# Altium project TechDemo.PrjPcb (part 1 of 2)
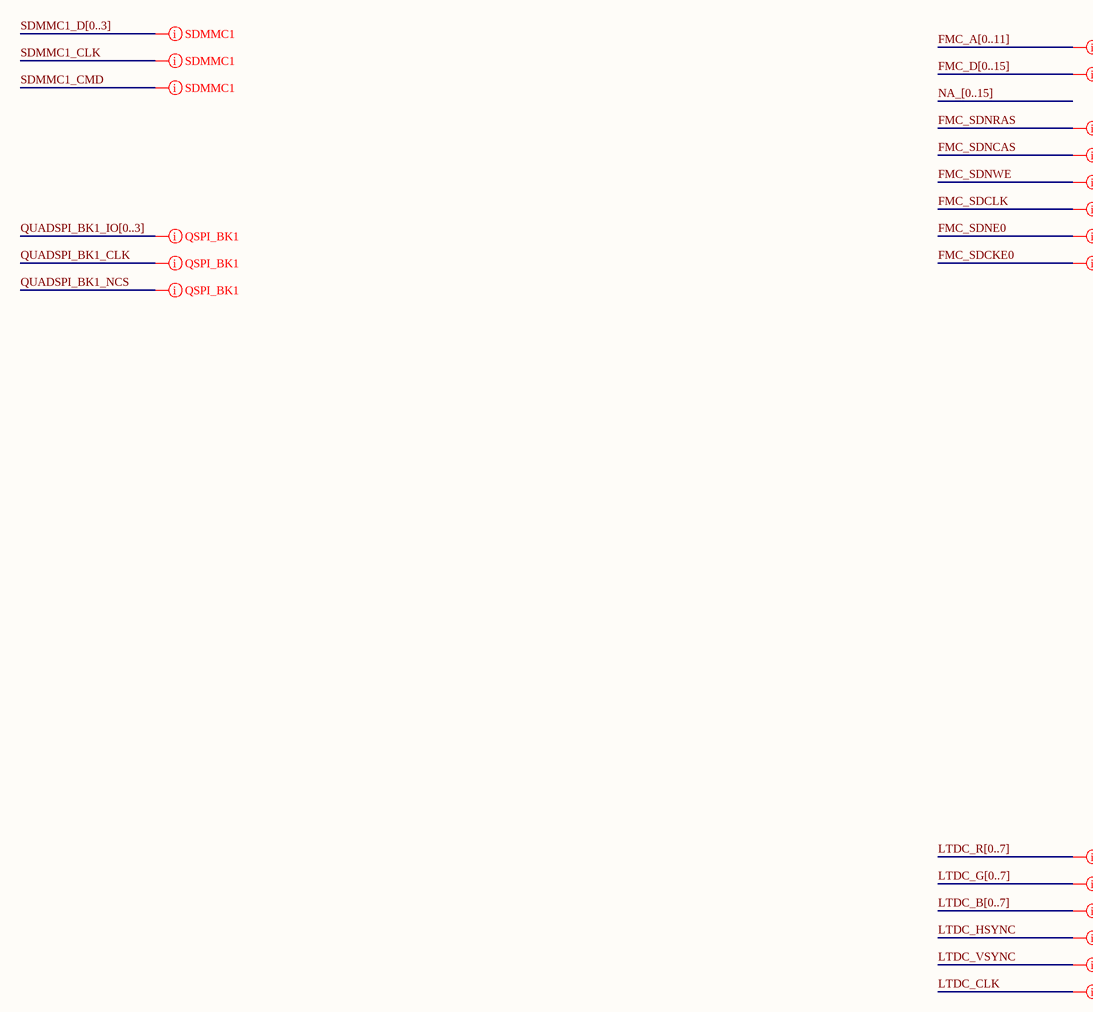
[diagram p0: TitleBlock.SchDoc]
ProjectDate: 10/29/2020; ProjectNumber: IMR_002; ProjectRevision: 1; ProjectTitle: IMR Technology Demonstrator
10 sheets, 244 parts. Net scope: global (net labels, ports and power ports of the same name join across sheets).
Board file: PCB_TechDemo.PcbDoc
Sheets:
  TitleBlock.SchDoc
  MainController.SchDoc
  MainControllerPower.SchDoc
  SystemMemory.SchDoc
  LCD_TouchBackLight.SchDoc
  SerialInterface.SchDoc
  UserInteractive.SchDoc
  AudioAmp.SchDoc
  Wifi.SchDoc
  Power.SchDoc

## Sheet TitleBlock.SchDoc: =ProjectTitle
size B; Date: 10/29/2020; Engineer: H. Collector; Organization: IMR Engineering; Address1: 3621 Gin Way; Address2: Snellville, GA 30039; Address3: USA; DocumentNumber: IMR_002; Revision: 1; SheetNumber: 1; SheetTotal: 10; Rule: UNIONINDEX=0|RULEKIND=MatchedLengths|NETSCOPE=DifferentNets|LAYERKIND=SameLayer|NAME=Schematic Matched Net Lengths|TOLERANCE=100mil|CHECKNETSINDIFFPAIR=FALSE|CHECKDIFFPAIRVSDIFFPAIR=TRUE|CHECKXSIGNALS=TRUE|CHECKOTHERS=TRUE|UNIT=Metric

### Buses and harness runs
bus FMC_A[0..11]
bus FMC_D[0..15]
bus LTDC_B[0..7]
bus LTDC_G[0..7]
bus LTDC_R[0..7]
bus NA_[0..15]
bus QUADSPI_BK1_IO[0..3]
bus SDMMC1_D[0..3]

### Layout directives
mark named TFT_LCD: (no net found under the mark), LTDC_CLK, LTDC_HSYNC, LTDC_VSYNC
rule Matched Net Lengths [Tolerance = 28mm]: (no net found under the mark)
rule Matched Net Lengths [Tolerance = 38mm]: (no net found under the mark), QUADSPI_BK1_CLK, QUADSPI_BK1_NCS, SDMMC1_CLK, SDMMC1_CMD
rule Matched Net Lengths [Tolerance = 28mm]; net class FMC_CTL: FMC_SDCKE0, FMC_SDCLK, FMC_SDNCAS, FMC_SDNE0, FMC_SDNRAS, FMC_SDNWE

### Notes on the sheet
- Title
- Size:
- Date:
- B
- Number:
- Engr:
- Revision:
- Sheet
- of
- File:

## Sheet MainController.SchDoc: =ProjectTitle
size B; Engineer: H. Collector; Organization: IMR Engineering; Address1: 3621 Gin Way; Address2: Snellville, GA 30039; Address3: USA; DocumentNumber: IMR_002; Revision: 1; SheetNumber: 2; SheetTotal: 10
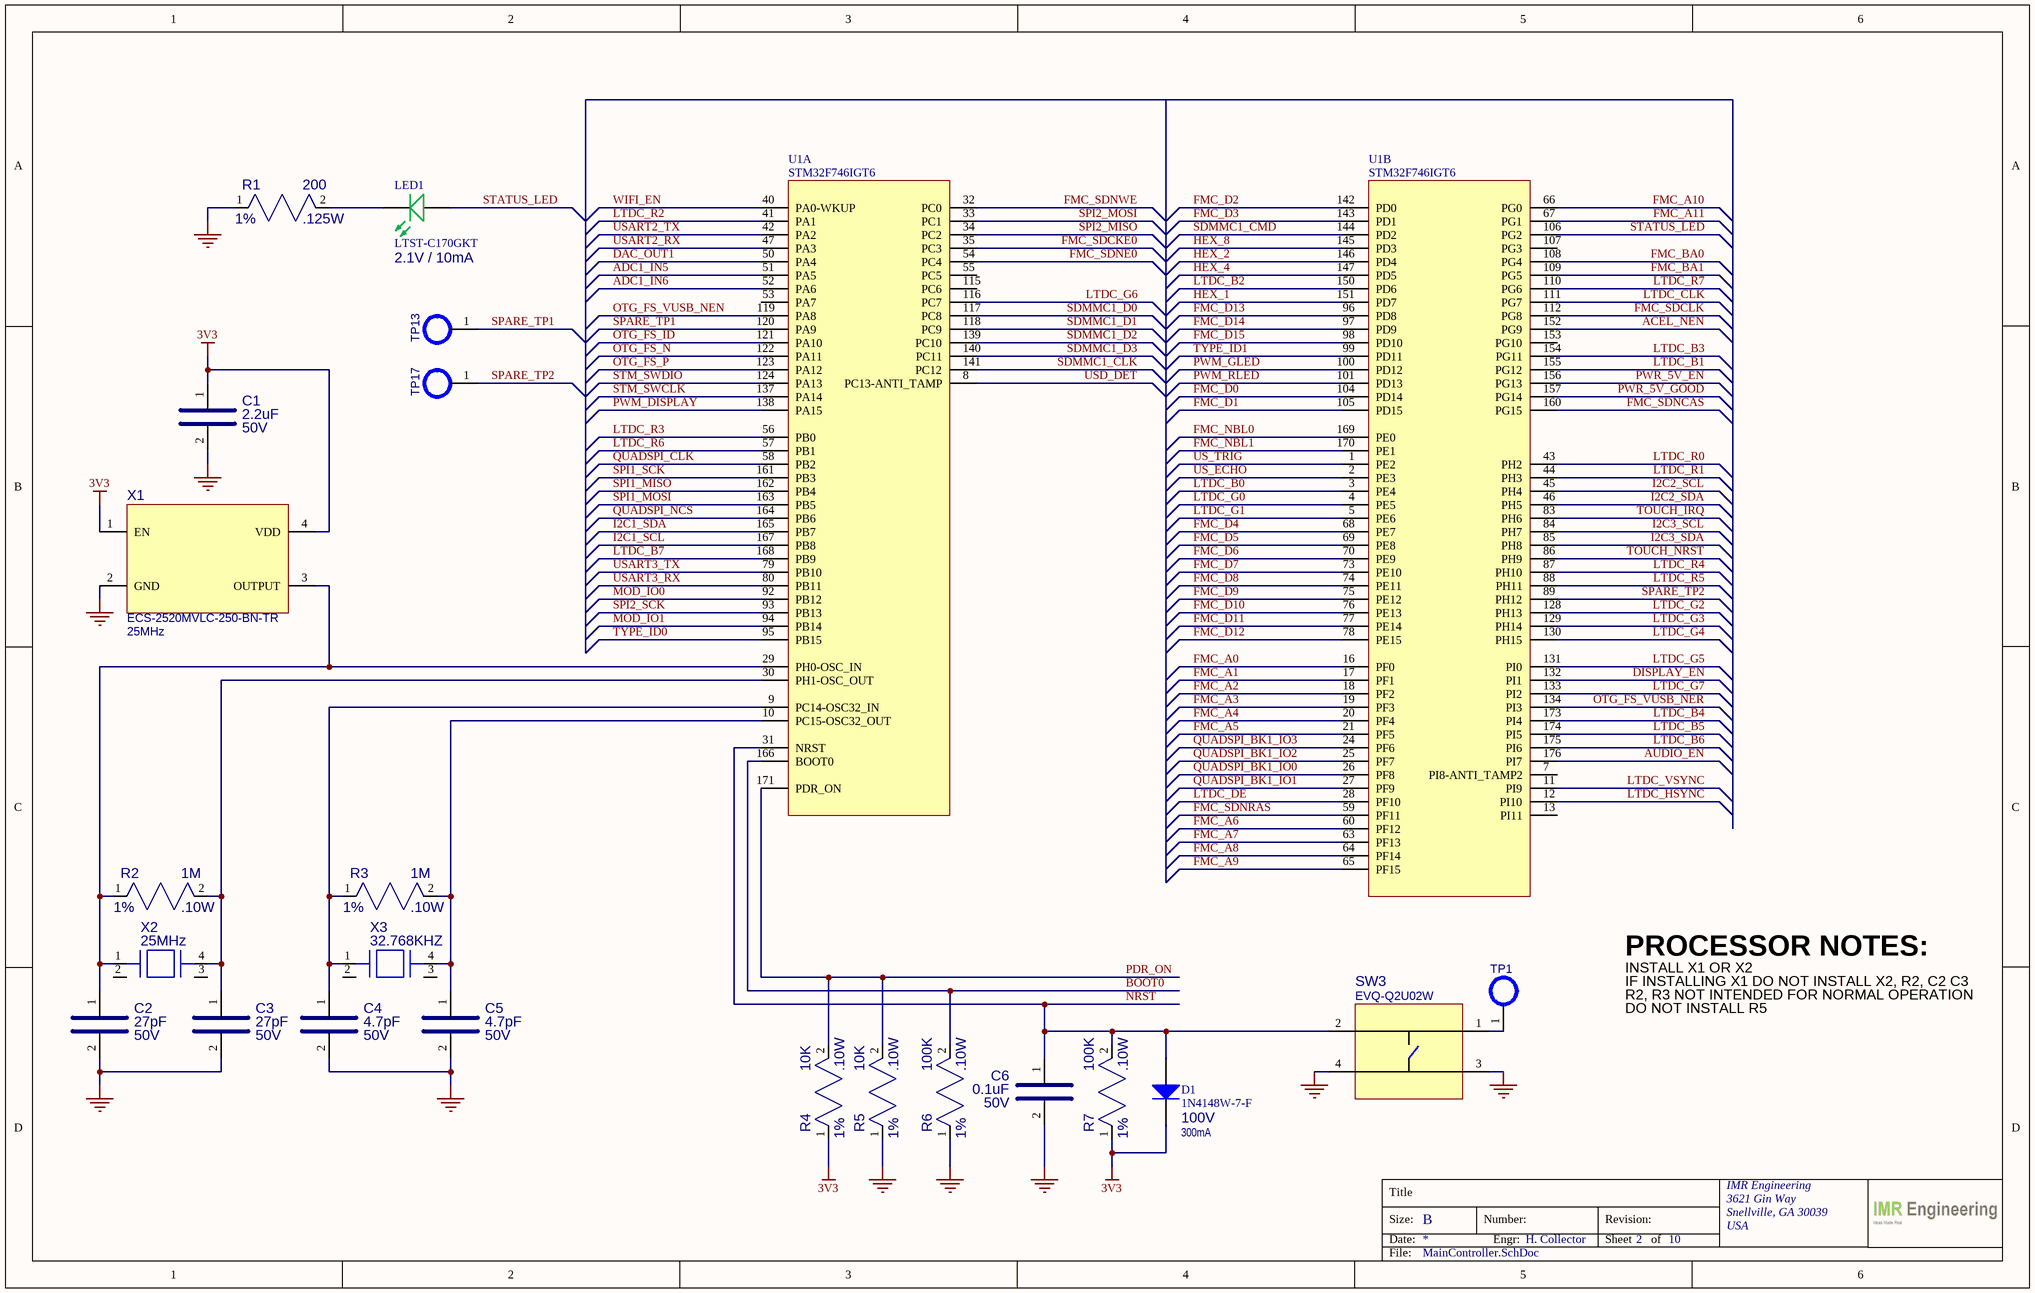
[diagram p1: MainController.SchDoc]

### Parts
C1  value 2.2uF  VOLTAGE: 50V  [CAP_0805]  (hidden comment: UMK212BB7225MG-T)
C2  value 27pF  VOLTAGE: 50V  [CAP_0603]  (hidden comment: CC0603KRNPO9BN270)
C3  value 27pF  VOLTAGE: 50V  [CAP_0603]  (hidden comment: CC0603KRNPO9BN270)
C4  value 4.7pF  VOLTAGE: 50V  [CAP_0603]  (hidden comment: CC0603CRNPO9BN4R7)
C5  value 4.7pF  VOLTAGE: 50V  [CAP_0603]  (hidden comment: CC0603CRNPO9BN4R7)
C6  value 0.1uF  VOLTAGE: 50V  [CAP_0603]  (hidden comment: CC0603KRX7R9BB104)
D1  value 100V  CURRENT: 300mA  [SOD123]  (hidden comment: 1N4148W-7-F)
LED1  value 2.1V / 10mA  [PMG_LTST-C170GKT]  (hidden comment: LTST-C170GKT)
R1  value 200  TOLERANCE: 1%  POWER: .125W  [RES_0805]  (hidden comment: RC0805FR-07200RL)
R2  value 1M  TOLERANCE: 1%  POWER: .10W  [RES_0603]  (hidden comment: RC0603FR-071ML)
R3  value 1M  TOLERANCE: 1%  POWER: .10W  [RES_0603]  (hidden comment: RC0603FR-071ML)
R4  value 10K  TOLERANCE: 1%  POWER: .10W  [RES_0603]  (hidden comment: RC0603FR-0710KL)
R5  value 10K  TOLERANCE: 1%  POWER: .10W  [RES_0603]  (hidden comment: RC0603FR-0710KL)
R6  value 100K  TOLERANCE: 1%  POWER: .10W  [RES_0603]  (hidden comment: RC0603FR-07100KL)
R7  value 100K  TOLERANCE: 1%  POWER: .10W  [RES_0603]  (hidden comment: RC0603FR-07100KL)
SW3  EVQ-Q2U02W  [SW_EVQ-Q2U02W]
TP1  TP_0635MM_HOLE  [TP_0635MM_HOLE]  (value not drawn)  (no BOM)
TP13  TP_0635MM_HOLE  [TP_0635MM_HOLE]  (value not drawn)  (no BOM)
TP17  TP_0635MM_HOLE  [TP_0635MM_HOLE]  (value not drawn)  (no BOM)
U1  STM32F746IGT6  [QFP50P2600X2600X160-176N]  (parts A,B of 3)
X1  value 25MHz  [OSC_ECS-2520S25-250-FN-TR]  (hidden comment: ECS-2520MVLC-250-BN-TR)
X2  value 25MHz  [XTAL_ECS]  (hidden comment: ECS-250-18-7SX-TR)
X3  value 32.768KHZ  [XTAL_ECS-.327-6-17X-TR]  (hidden comment: MC-306 32.7680K-E0:PURE SN)

### Nets
3V3: C1.1 D1.2(K) R4.1 R7.1 X1.1(EN) X1.4(VDD)
GND: C1.2 C2.2 C3.2 C4.2 C5.2 C6.2 R1.1 R5.1 R6.1 SW3.3(A) SW3.4(A') X1.2(GND)
ACEL_NEN: U1.152(PG9)
ADC1_IN5: U1.51(PA5)
ADC1_IN6: U1.52(PA6)
AUDIO_EN: U1.176(PI7)
BOOT0: R6.2 U1.166(BOOT0)
DAC_OUT1: U1.50(PA4)
DISPLAY_EN: U1.132(PI1)
FMC_A0: U1.16(PF0)
FMC_A1: U1.17(PF1)
FMC_A2: U1.18(PF2)
FMC_A3: U1.19(PF3)
FMC_A4: U1.20(PF4)
FMC_A5: U1.21(PF5)
FMC_A6: U1.60(PF12)
FMC_A7: U1.63(PF13)
FMC_A8: U1.64(PF14)
FMC_A9: U1.65(PF15)
FMC_A10: U1.66(PG0)
FMC_A11: U1.67(PG1)
FMC_BA0: U1.108(PG4)
FMC_BA1: U1.109(PG5)
FMC_D0: U1.104(PD14)
FMC_D1: U1.105(PD15)
FMC_D2: U1.142(PD0)
FMC_D3: U1.143(PD1)
FMC_D4: U1.68(PE7)
FMC_D5: U1.69(PE8)
FMC_D6: U1.70(PE9)
FMC_D7: U1.73(PE10)
FMC_D8: U1.74(PE11)
FMC_D9: U1.75(PE12)
FMC_D10: U1.76(PE13)
FMC_D11: U1.77(PE14)
FMC_D12: U1.78(PE15)
FMC_D13: U1.96(PD8)
FMC_D14: U1.97(PD9)
FMC_D15: U1.98(PD10)
FMC_NBL0: U1.169(PE0)
FMC_NBL1: U1.170(PE1)
FMC_SDCKE0: U1.35(PC3)
FMC_SDCLK: U1.112(PG8)
FMC_SDNCAS: U1.160(PG15)
FMC_SDNE0: U1.54(PC4)
FMC_SDNRAS: U1.59(PF11)
FMC_SDNWE: U1.32(PC0)
HEX_1: U1.151(PD7)
HEX_2: U1.146(PD4)
HEX_4: U1.147(PD5)
HEX_8: U1.145(PD3)
I2C1_SCL: U1.167(PB8)
I2C1_SDA: U1.165(PB7)
I2C2_SCL: U1.45(PH4)
I2C2_SDA: U1.46(PH5)
I2C3_SCL: U1.84(PH7)
I2C3_SDA: U1.85(PH8)
LTDC_B0: U1.3(PE4)
LTDC_B1: U1.155(PG12)
LTDC_B2: U1.150(PD6)
LTDC_B3: U1.154(PG11)
LTDC_B4: U1.173(PI4)
LTDC_B5: U1.174(PI5)
LTDC_B6: U1.175(PI6)
LTDC_B7: U1.168(PB9)
LTDC_CLK: U1.111(PG7)
LTDC_DE: U1.28(PF10)
LTDC_G0: U1.4(PE5)
LTDC_G1: U1.5(PE6)
LTDC_G2: U1.128(PH13)
LTDC_G3: U1.129(PH14)
LTDC_G4: U1.130(PH15)
LTDC_G5: U1.131(PI0)
LTDC_G6: U1.116(PC7)
LTDC_G7: U1.133(PI2)
LTDC_HSYNC: U1.12(PI10)
LTDC_R0: U1.43(PH2)
LTDC_R1: U1.44(PH3)
LTDC_R2: U1.41(PA1)
LTDC_R3: U1.56(PB0)
LTDC_R4: U1.87(PH10)
LTDC_R5: U1.88(PH11)
LTDC_R6: U1.57(PB1)
LTDC_R7: U1.110(PG6)
LTDC_VSYNC: U1.11(PI9)
MOD_IO0: U1.92(PB12)
MOD_IO1: U1.94(PB14)
NRST: C6.1 D1.1(A) R7.2 SW3.2(B') U1.31(NRST)
OTG_FS_ID: U1.121(PA10)
OTG_FS_N: U1.122(PA11)
OTG_FS_P: U1.123(PA12)
OTG_FS_VUSB_NEN: U1.119(PA8)
OTG_FS_VUSB_NER: U1.134(PI3)
PDR_ON: R4.2 R5.2 U1.171(PDR_ON)
PWM_DISPLAY: U1.138(PA15)
PWM_GLED: U1.100(PD12)
PWM_RLED: U1.101(PD13)
PWR_5V_EN: U1.156(PG13)
PWR_5V_GOOD: U1.157(PG14)
QUADSPI_BK1_IO0: U1.26(PF8)
QUADSPI_BK1_IO1: U1.27(PF9)
QUADSPI_BK1_IO2: U1.25(PF7)
QUADSPI_BK1_IO3: U1.24(PF6)
QUADSPI_CLK: U1.58(PB2)
QUADSPI_NCS: U1.164(PB6)
SDMMC1_CLK: U1.141(PC12)
SDMMC1_CMD: U1.144(PD2)
SDMMC1_D0: U1.117(PC8)
SDMMC1_D1: U1.118(PC9)
SDMMC1_D2: U1.139(PC10)
SDMMC1_D3: U1.140(PC11)
SPARE_TP1: TP13.1 U1.120(PA9)
SPARE_TP2: TP17.1 U1.89(PH12)
SPI1_MISO: U1.162(PB4)
SPI1_MOSI: U1.163(PB5)
SPI1_SCK: U1.161(PB3)
SPI2_MISO: U1.34(PC2)
SPI2_MOSI: U1.33(PC1)
SPI2_SCK: U1.93(PB13)
STATUS_LED: LED1.1(A) U1.106(PG2)
STM_SWCLK: U1.137(PA14)
STM_SWDIO: U1.124(PA13)
TOUCH_IRQ: U1.83(PH6)
TOUCH_NRST: U1.86(PH9)
TYPE_ID0: U1.95(PB15)
TYPE_ID1: U1.99(PD11)
US_ECHO: U1.2(PE3)
US_TRIG: U1.1(PE2)
USART2_RX: U1.47(PA3)
USART2_TX: U1.42(PA2)
USART3_RX: U1.80(PB11)
USART3_TX: U1.79(PB10)
USD_DET: U1.8(PC13-ANTI_TAMP)
WIFI_EN: U1.40(PA0-WKUP)
NetC2_1: C2.1 R2.1 U1.29(PH0-OSC_IN) X1.3(OUTPUT) X2.1
NetC3_1: C3.1 R2.2 U1.30(PH1-OSC_OUT) X2.4
NetC4_1: C4.1 R3.1 U1.9(PC14-OSC32_IN) X3.1
NetC5_1: C5.1 R3.2 U1.10(PC15-OSC32_OUT) X3.4
NetLED1_2: LED1.2(K) R1.2
NetSW3_1: SW3.1(B) TP1.1

Not connected (* = marked no-connect by the designer): U1 7(PI8-ANTI_TAMP2) 13(PI11) 53(PA7) 55(PC5) 107(PG3) 115(PC6) 153(PG10); X2 2 3; X3 2 3

### Notes on the sheet
- PROCESSOR NOTES:
- INSTALL X1 OR X2
- IF INSTALLING X1 DO NOT INSTALL X2, R2, C2 C3
- R2, R3 NOT INTENDED FOR NORMAL OPERATION
- DO NOT INSTALL R5
- Title
- Size:
- Date:
- B
- Number:
- Engr:
- Revision:
- Sheet
- of
- File:

### Library data of the parts
C1 = CAP_2.2UF_50V_0805: CAP CER 2.2UF 50V X7R 0805; MFG: Taiyo Yuden; TOLERANCE: 20%; MFG_PN: UMK212BB7225MG-T; Supplier 1: Digi-Key; Supplier Part Number 1: 587-4963-1-ND; Case/Package: 0805
C2 C3 = CAP_27PF_50V_0603: CAP CER 4.7PF 50V C0G/NPO 0603; MFG: Yageo; TOLERANCE: 10%; MFG_PN: CC0603KRNPO9BN270; Supplier 1: Digi-Key; Supplier Part Number 1: 311-4032-1-ND; Case/Package: 0603
C4 C5 = CAP_4.7PF_50V_0603: CAP CER 4.7PF 50V C0G/NPO 0603; MFG: Yageo; TOLERANCE: +/-.25pF; MFG_PN: CC0603CRNPO9BN4R7; Supplier 1: Digi-Key; Supplier Part Number 1: 311-1740-1-ND; Case/Package: 0603
C6 = CAP_0.1UF_50V_0603: CAP CER 0.1UF 50V X7R 0603; MFG: Yageo; TOLERANCE: 10%; MFG_PN: CC0603KRX7R9BB104; Supplier 1: Digi-Key; Supplier Part Number 1: 311-1344-1-ND; Case/Package: 0603
D1 = DIODE_1N4148W-7-F: DIODE GEN PURP 100V 300MA SOD123; MFG: Diodes Incorporated; Case/Package: SOD-123; Supplier 1: Digi-Key; Supplier Part Number 1: 1N4148W-FDICT-ND; MFG_PN: 1N4148W-7-F
LED1 = DIODE_LED_GREEN_LTST-C170GKT: DIODE, LED GREEN CLEAR SMD; MFG: Lite-On Inc.; Case/Package: 0805; Supplier 1: Digi-Key; Supplier Part Number 1: 160-1179-1-ND; MFG_PN: LTST-C170GKT
R1 = RES_200_0805_1/8W_1%_1: RES SMD 200 OHM 1% 1/8W 0805; MFG: Yageo; Case/Package: 0805; MFG_PN: RC0805FR-07200RL; Supplier 1: Digi-Key; Supplier Part Number 1: 311-200CRCT-ND
R2 R3 = RES_1M_0603_1/10W_1%: RES SMD 1M OHM 1% 1/10W 0603; MFG: Yageo; Case/Package: 0603; MFG_PN: RC0603FR-071ML; Supplier 1: Digi-Key; Supplier Part Number 1: 311-1.00MHRCT-ND
R4 R5 = RES_10K_0603_1/10W_1%: RES SMD 10K OHM 1% 1/10W 0603; MFG: Yageo; Case/Package: 0603; MFG_PN: RC0603FR-0710KL; Supplier 1: Digi-Key; Supplier Part Number 1: 311-10.0KHRCT-ND
R6 R7 = RES_100K_0603_1/10W_1%: RES SMD 100K OHM 1% 1/10W 0603; MFG: Yageo; Case/Package: 0603; MFG_PN: RC0603FR-07100KL; Supplier 1: Digi-Key; Supplier Part Number 1: 311-100KHRCT-ND
SW3 = SWITCH_EVQ-Q2U02W: SWITCH TACTILE SPST-NO 0.02A 15V; MFG: Panasonic Electronic Components; Case/Package: EVQ-Q2; Supplier 1: Digi-Key; Supplier Part Number 1: P12954SCT-ND; VALUE: 15V; MFG_PN: EVQ-Q2U02W
TP1 TP13 TP17 = TP_0635MM_HOLE: 3MM IN D. MT HOLE
U1 = IC_STM32F746NGH6U: STM32F746NGH6 (STM32F7 Birdie) TBGA216; MFG: STMicroelectronics; Value: 216MHz 1MB; Case/Package: 176LQFP; MFG_PN: STM32F746IGT6; Supplier 1: DigiKey; Supplier Part Number 1: 497-15817-ND
X1 = IC_OSC_ECS-2520MVLC-250-BN-TR: XTAL OSC XO 25MHZ CMOS SMD; MFG: ECS Inc.; MFG_PN: ECS-2520MVLC-250-BN-TR; Supplier 1: Digi-Key; Supplier Part Number 1: 50-ECS-2520MVLC-250-BN-CT-ND; Case/Package: 4-SMD
X2 = XTAL_25HZ_6PF_SMD: CRYSTAL 25.0000MHZ 18PF SMD; MFG: ECS Inc.; TOLERANCE: 30PPM; MFG_PN: ECS-250-18-7SX-TR; Supplier 1: Digi-Key; Supplier Part Number 1: XC2030-1-ND; Case/Package: XTAL_ECS
X3 = XTAL_32.768KHZ_6PF_SMD: CRYSTAL 32.7680KHZ 6PF SMD; MFG: EPSON; TOLERANCE: 100ppm; MFG_PN: MC-306 32.7680K-E0:PURE SN; Supplier 1: Digi-Key; Supplier Part Number 1: SER4097CT-ND; Case/Package: XTAL_ECS

## Sheet MainControllerPower.SchDoc: =ProjectTitle
size B; Engineer: H. Collector; Organization: IMR Engineering; Address1: 3621 Gin Way; Address2: Snellville, GA 30039; Address3: USA; DocumentNumber: IMR_002; Revision: 1; SheetNumber: 3; SheetTotal: 10
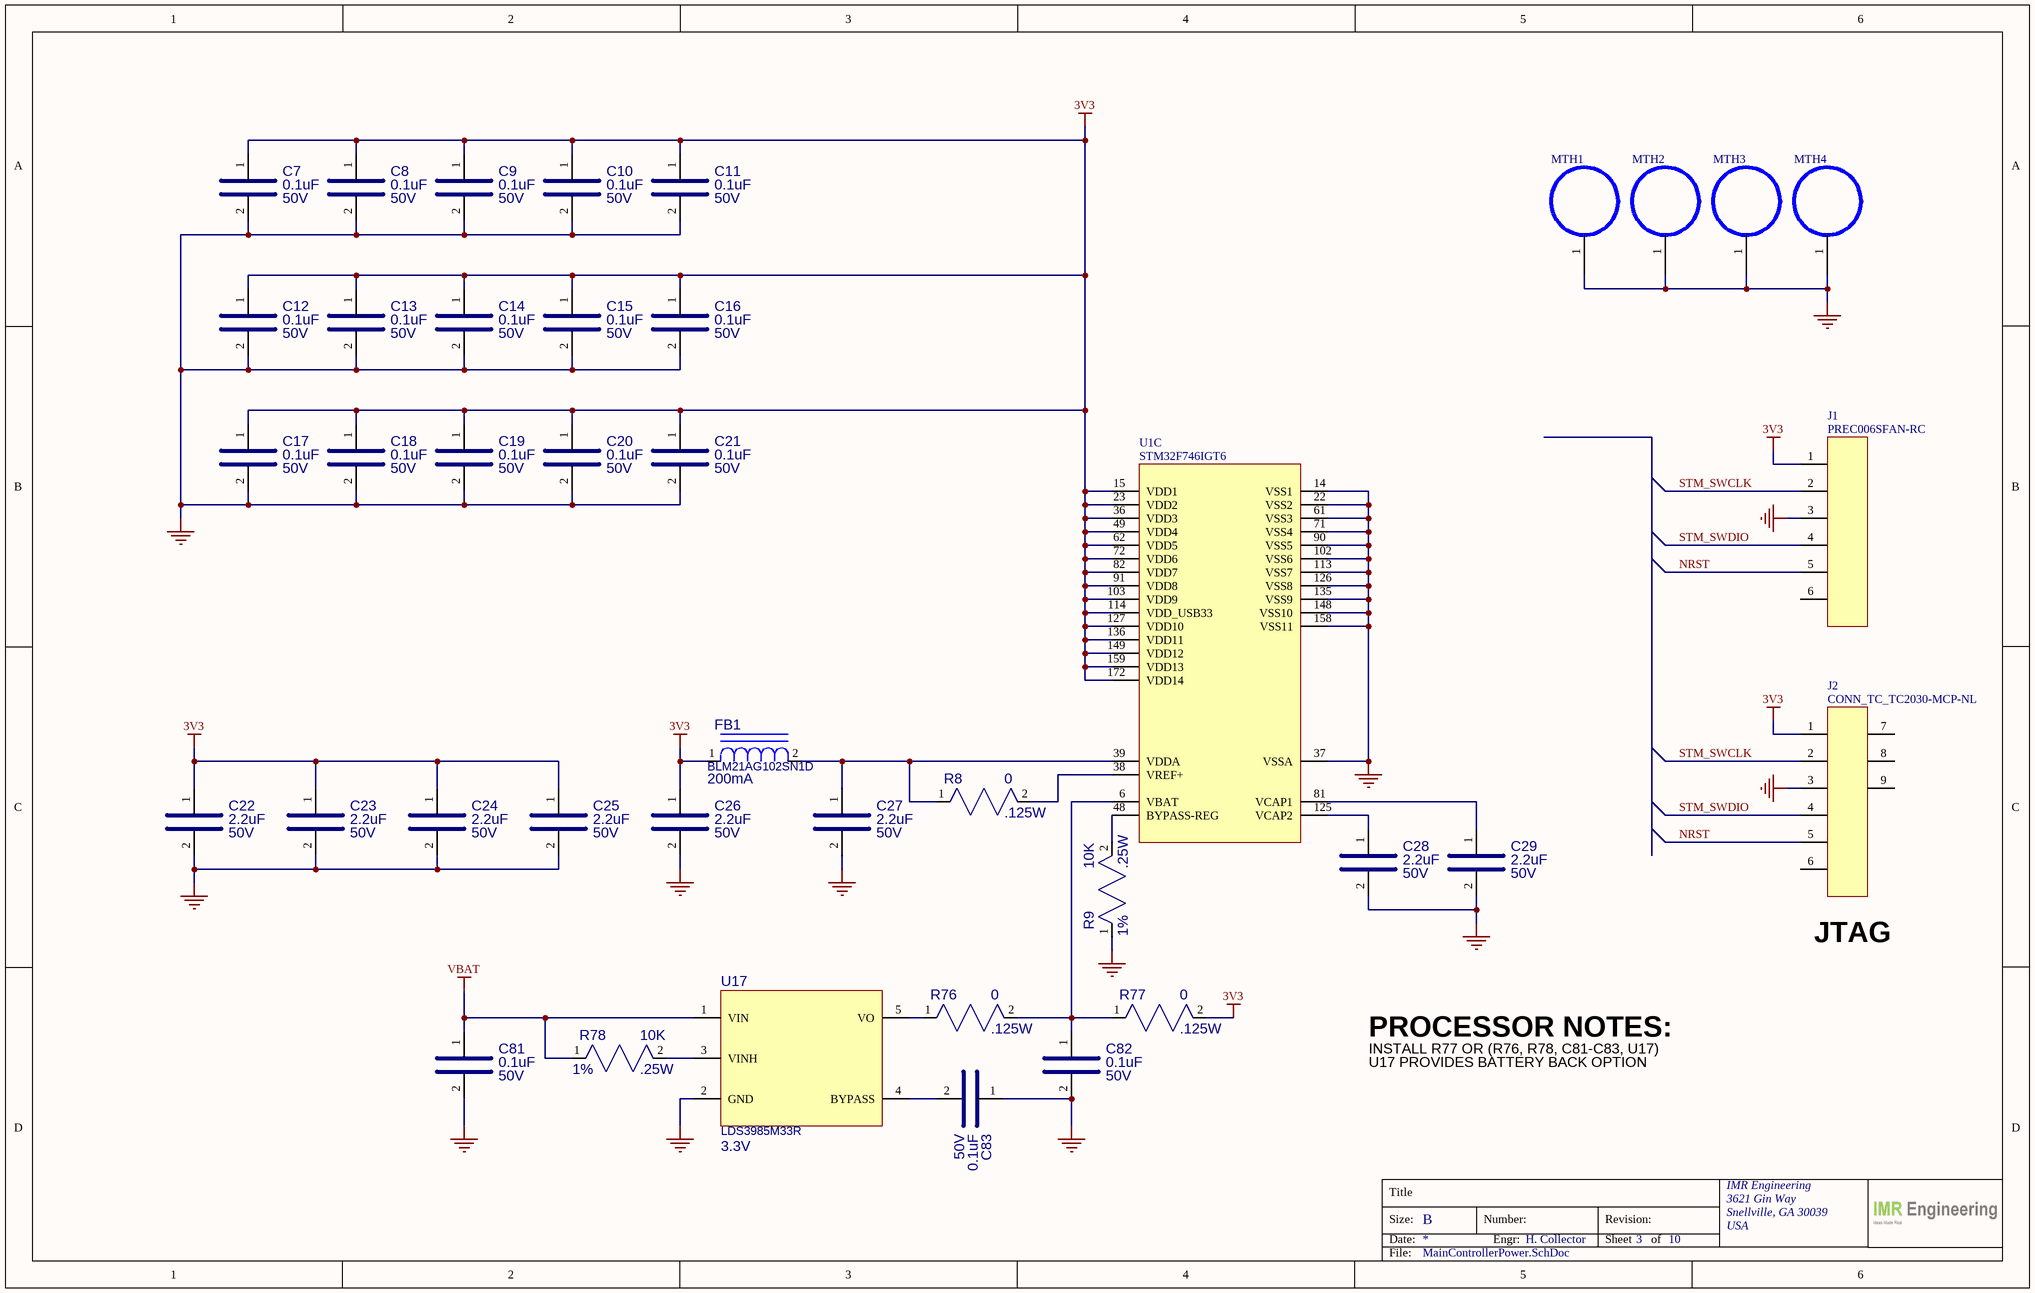
[diagram p2: MainControllerPower.SchDoc]

### Parts
C7  value 0.1uF  VOLTAGE: 50V  [CAP_0603]  (hidden comment: CC0603KRX7R9BB104)
C8  value 0.1uF  VOLTAGE: 50V  [CAP_0603]  (hidden comment: CC0603KRX7R9BB104)
C9  value 0.1uF  VOLTAGE: 50V  [CAP_0603]  (hidden comment: CC0603KRX7R9BB104)
C10  value 0.1uF  VOLTAGE: 50V  [CAP_0603]  (hidden comment: CC0603KRX7R9BB104)
C11  value 0.1uF  VOLTAGE: 50V  [CAP_0603]  (hidden comment: CC0603KRX7R9BB104)
C12  value 0.1uF  VOLTAGE: 50V  [CAP_0603]  (hidden comment: CC0603KRX7R9BB104)
C13  value 0.1uF  VOLTAGE: 50V  [CAP_0603]  (hidden comment: CC0603KRX7R9BB104)
C14  value 0.1uF  VOLTAGE: 50V  [CAP_0603]  (hidden comment: CC0603KRX7R9BB104)
C15  value 0.1uF  VOLTAGE: 50V  [CAP_0603]  (hidden comment: CC0603KRX7R9BB104)
C16  value 0.1uF  VOLTAGE: 50V  [CAP_0603]  (hidden comment: CC0603KRX7R9BB104)
C17  value 0.1uF  VOLTAGE: 50V  [CAP_0603]  (hidden comment: CC0603KRX7R9BB104)
C18  value 0.1uF  VOLTAGE: 50V  [CAP_0603]  (hidden comment: CC0603KRX7R9BB104)
C19  value 0.1uF  VOLTAGE: 50V  [CAP_0603]  (hidden comment: CC0603KRX7R9BB104)
C20  value 0.1uF  VOLTAGE: 50V  [CAP_0603]  (hidden comment: CC0603KRX7R9BB104)
C21  value 0.1uF  VOLTAGE: 50V  [CAP_0603]  (hidden comment: CC0603KRX7R9BB104)
C22  value 2.2uF  VOLTAGE: 50V  [CAP_0805]  (hidden comment: UMK212BB7225MG-T)
C23  value 2.2uF  VOLTAGE: 50V  [CAP_0805]  (hidden comment: UMK212BB7225MG-T)
C24  value 2.2uF  VOLTAGE: 50V  [CAP_0805]  (hidden comment: UMK212BB7225MG-T)
C25  value 2.2uF  VOLTAGE: 50V  [CAP_0805]  (hidden comment: UMK212BB7225MG-T)
C26  value 2.2uF  VOLTAGE: 50V  [CAP_0805]  (hidden comment: UMK212BB7225MG-T)
C27  value 2.2uF  VOLTAGE: 50V  [CAP_0805]  (hidden comment: UMK212BB7225MG-T)
C28  value 2.2uF  VOLTAGE: 50V  [CAP_0805]  (hidden comment: UMK212BB7225MG-T)
C29  value 2.2uF  VOLTAGE: 50V  [CAP_0805]  (hidden comment: UMK212BB7225MG-T)
C81  value 0.1uF  VOLTAGE: 50V  [CAP_0805]  (hidden comment: 08055C104KAT2A)
C82  value 0.1uF  VOLTAGE: 50V  [CAP_0805]  (hidden comment: 08055C104KAT2A)
C83  value 0.1uF  VOLTAGE: 50V  [CAP_0805]  (hidden comment: 08055C104KAT2A)
FB1  value 200mA  [RES_0805]  (hidden comment: BLM21AG102SN1D)
J1  PREC006SFAN-RC  [HDR_1X6_100MILL]
J2  CONN_TC_TC2030-MCP-NL  [TC2030-MCP-NL-]  (no BOM)
MTH1  MOUNT_HOLE_3MM_ID  [MT_HOLE_3MM_5MM]  (value not drawn)  (no BOM)
MTH2  MOUNT_HOLE_3MM_ID  [MT_HOLE_3MM_5MM]  (value not drawn)  (no BOM)
MTH3  MOUNT_HOLE_3MM_ID  [MT_HOLE_3MM_5MM]  (value not drawn)  (no BOM)
MTH4  MOUNT_HOLE_3MM_ID  [MT_HOLE_3MM_5MM]  (value not drawn)  (no BOM)
R8  value 0  POWER: .125W  [PMG_RES_0805]  (hidden comment: RC0805JR-070RL)
R9  value 10K  TOLERANCE: 1%  POWER: .25W  [RES_0805]  (hidden comment: SG73S2ATTD1002F)
R76  value 0  POWER: .125W  [PMG_RES_0805]  (hidden comment: RC0805JR-070RL)
R77  value 0  POWER: .125W  [PMG_RES_0805]  (hidden comment: RC0805JR-070RL)
R78  value 10K  TOLERANCE: 1%  POWER: .25W  [RES_0805]  (hidden comment: SG73S2ATTD1002F)
U1  STM32F746IGT6  [QFP50P2600X2600X160-176N]  (part C of 3)
U17  value 3.3V  [SOT23-5]  (hidden comment: LDS3985M33R)

### Nets
3V3: C7.1 C8.1 C9.1 C10.1 C11.1 C12.1 C13.1 C14.1 C15.1 C16.1 C17.1 C18.1 C19.1 C20.1 C21.1 C22.1 C23.1 C24.1 C25.1 C26.1 FB1.1 J1.1 J2.1 R77.2 U1.15(VDD1) U1.23(VDD2) U1.36(VDD3) U1.49(VDD4) U1.62(VDD5) U1.72(VDD6) U1.82(VDD7) U1.91(VDD8) U1.103(VDD9) U1.114(VDD_USB33) U1.127(VDD10) U1.136(VDD11) U1.149(VDD12) U1.159(VDD13) U1.172(VDD14)
GND: C7.2 C8.2 C9.2 C10.2 C11.2 C12.2 C13.2 C14.2 C15.2 C16.2 C17.2 C18.2 C19.2 C20.2 C21.2 C22.2 C23.2 C24.2 C25.2 C26.2 C27.2 C28.2 C29.2 C81.2 C82.2 C83.1 J1.3 J2.3 MTH1.1 MTH2.1 MTH3.1 MTH4.1 R9.1 U1.14(VSS1) U1.22(VSS2) U1.37(VSSA) U1.61(VSS3) U1.71(VSS4) U1.90(VSS5) U1.102(VSS6) U1.113(VSS7) U1.126(VSS8) U1.135(VSS9) U1.148(VSS10) U1.158(VSS11) U17.2(GND)
VBAT: C81.1 R78.1 U17.1(VIN)
NRST: J1.5 J2.5
STM_SWCLK: J1.2 J2.2
STM_SWDIO: J1.4 J2.4
NetC27_1: C27.1 FB1.2 R8.1 U1.39(VDDA)
NetC28_1: C28.1 U1.125(VCAP2)
NetC29_1: C29.1 U1.81(VCAP1)
NetC82_1: C82.1 R76.2 R77.1 U1.6(VBAT)
NetC83_2: C83.2 U17.4(BYPASS)
NetR8_2: R8.2 U1.38(VREF+)
NetR9_2: R9.2 U1.48(BYPASS-REG)
NetR76_1: R76.1 U17.5(VO)
NetR78_2: R78.2 U17.3(VINH)

Not connected (* = marked no-connect by the designer): J1 6; J2 6 7 8 9

### Notes on the sheet
- (near J2) JTAG
- PROCESSOR NOTES:
- INSTALL R77 OR (R76, R78, C81-C83, U17)
- U17 PROVIDES BATTERY BACK OPTION
- Title
- Size:
- Date:
- B
- Number:
- Engr:
- Revision:
- Sheet
- of
- File:

### Library data of the parts
C7-C21 = CAP_0.1UF_50V_0603: as C6 on sheet MainController; MFG_PN: CC0603KRX7R9BB104; Supplier 1: Digi-Key; Supplier Part Number 1: 311-1344-1-ND; Case/Package: 0603
C22-C29 = CAP_2.2UF_50V_0805: as C1 on sheet MainController; MFG_PN: UMK212BB7225MG-T; Supplier 1: Digi-Key; Supplier Part Number 1: 587-4963-1-ND; Case/Package: 0805
C81-C83 = CAP_0.1UF_50V_0805: CAP CER 0.1UF 50V X7R 0805; MFG: AVX; TOLERANCE: 10%; MFG_PN: 08055C104KAT2A; Supplier 1: Digi-Key; Supplier Part Number 1: 478-1395-1-ND; Case/Package: 0805; ClassName: UI_UltraSonic
FB1 = FERRITE_BLM21AG102SN1D: FERRITE, 1KOHM AT 100MHZ, 220MA, .450DCR; MFG: MURATA; TOLERANCE: 10%; Supplier 1: Digi-Key; Supplier Part Number 1: 490-1041-1-ND; MFG_PN: BLM21AG102SN1D
J1 = CONN_6P_SINGLE_ROW: CONN HEADER VERT 6POS 2.54MM; MFG: Sullins Connector Solutions; Case/Package: 6P_2.54MM; MFG_PN: PREC006SFAN-RC; Supplier 1: Digi-Key; Supplier Part Number 1: S1212EC-06-ND; Value: *
J2 = CONN_TC_TC2030-MCP-NL: CABLE TAG-CONNECT IN-CIRCUIT; MFG: Tag-Connect LLC; Case/Package: *; MFG_PN: TC2030-MCP-NL; Supplier 1: Digi-Key; Supplier Part Number 1: TC2030-MCP-NLTC-ND; Value: *
MTH1-MTH4 = MOUNT_HOLE_3MM_ID: 3MM IN D. MT HOLE
R8 R76 R77 = RES_0_0805_1/8W: RES SMD 0 OHM JUMPER 1/8W 0805; MFG: Yageo; Case/Package: 0805; MFG_PN: RC0805JR-070RL; Supplier 1: Digi-Key; Supplier Part Number 1: 311-0.0ARCT-ND; TOLERANCE: JUMPER
R9 R78 = RES_10K_0805_1/4W_1%: RES SMD 10K OHM 1% 1/4W 0805; MFG: KOA Speer Electronics, Inc.; Case/Package: 0805; MFG_PN: SG73S2ATTD1002F; Supplier 1: Digi-Key; Supplier Part Number 1: 2019-SG73S2ATTD1002FCT-ND
U1 = IC_STM32F746NGH6U: as U1 on sheet MainController; Case/Package: 176LQFP; MFG_PN: STM32F746IGT6; Supplier 1: DigiKey; Supplier Part Number 1: 497-15817-ND
U17 = IC_LDS3985M33R: IC REG LINEAR 3.3V 300MA SOT23-5; MFG: STMicroelectronics; Supplier 1: Digi-Key; Supplier Part Number 1: 497-4257-1-ND; MFG_PN: LDS3985M33R

## Sheet SystemMemory.SchDoc: =ProjectTitle
size B; Date: 10/29/2020; Engineer: H. Collector; Organization: IMR Engineering; Address1: 3621 Gin Way; Address2: Snellville, GA 30039; Address3: USA; DocumentNumber: IMR_002; Revision: 1; SheetNumber: 4; SheetTotal: 10
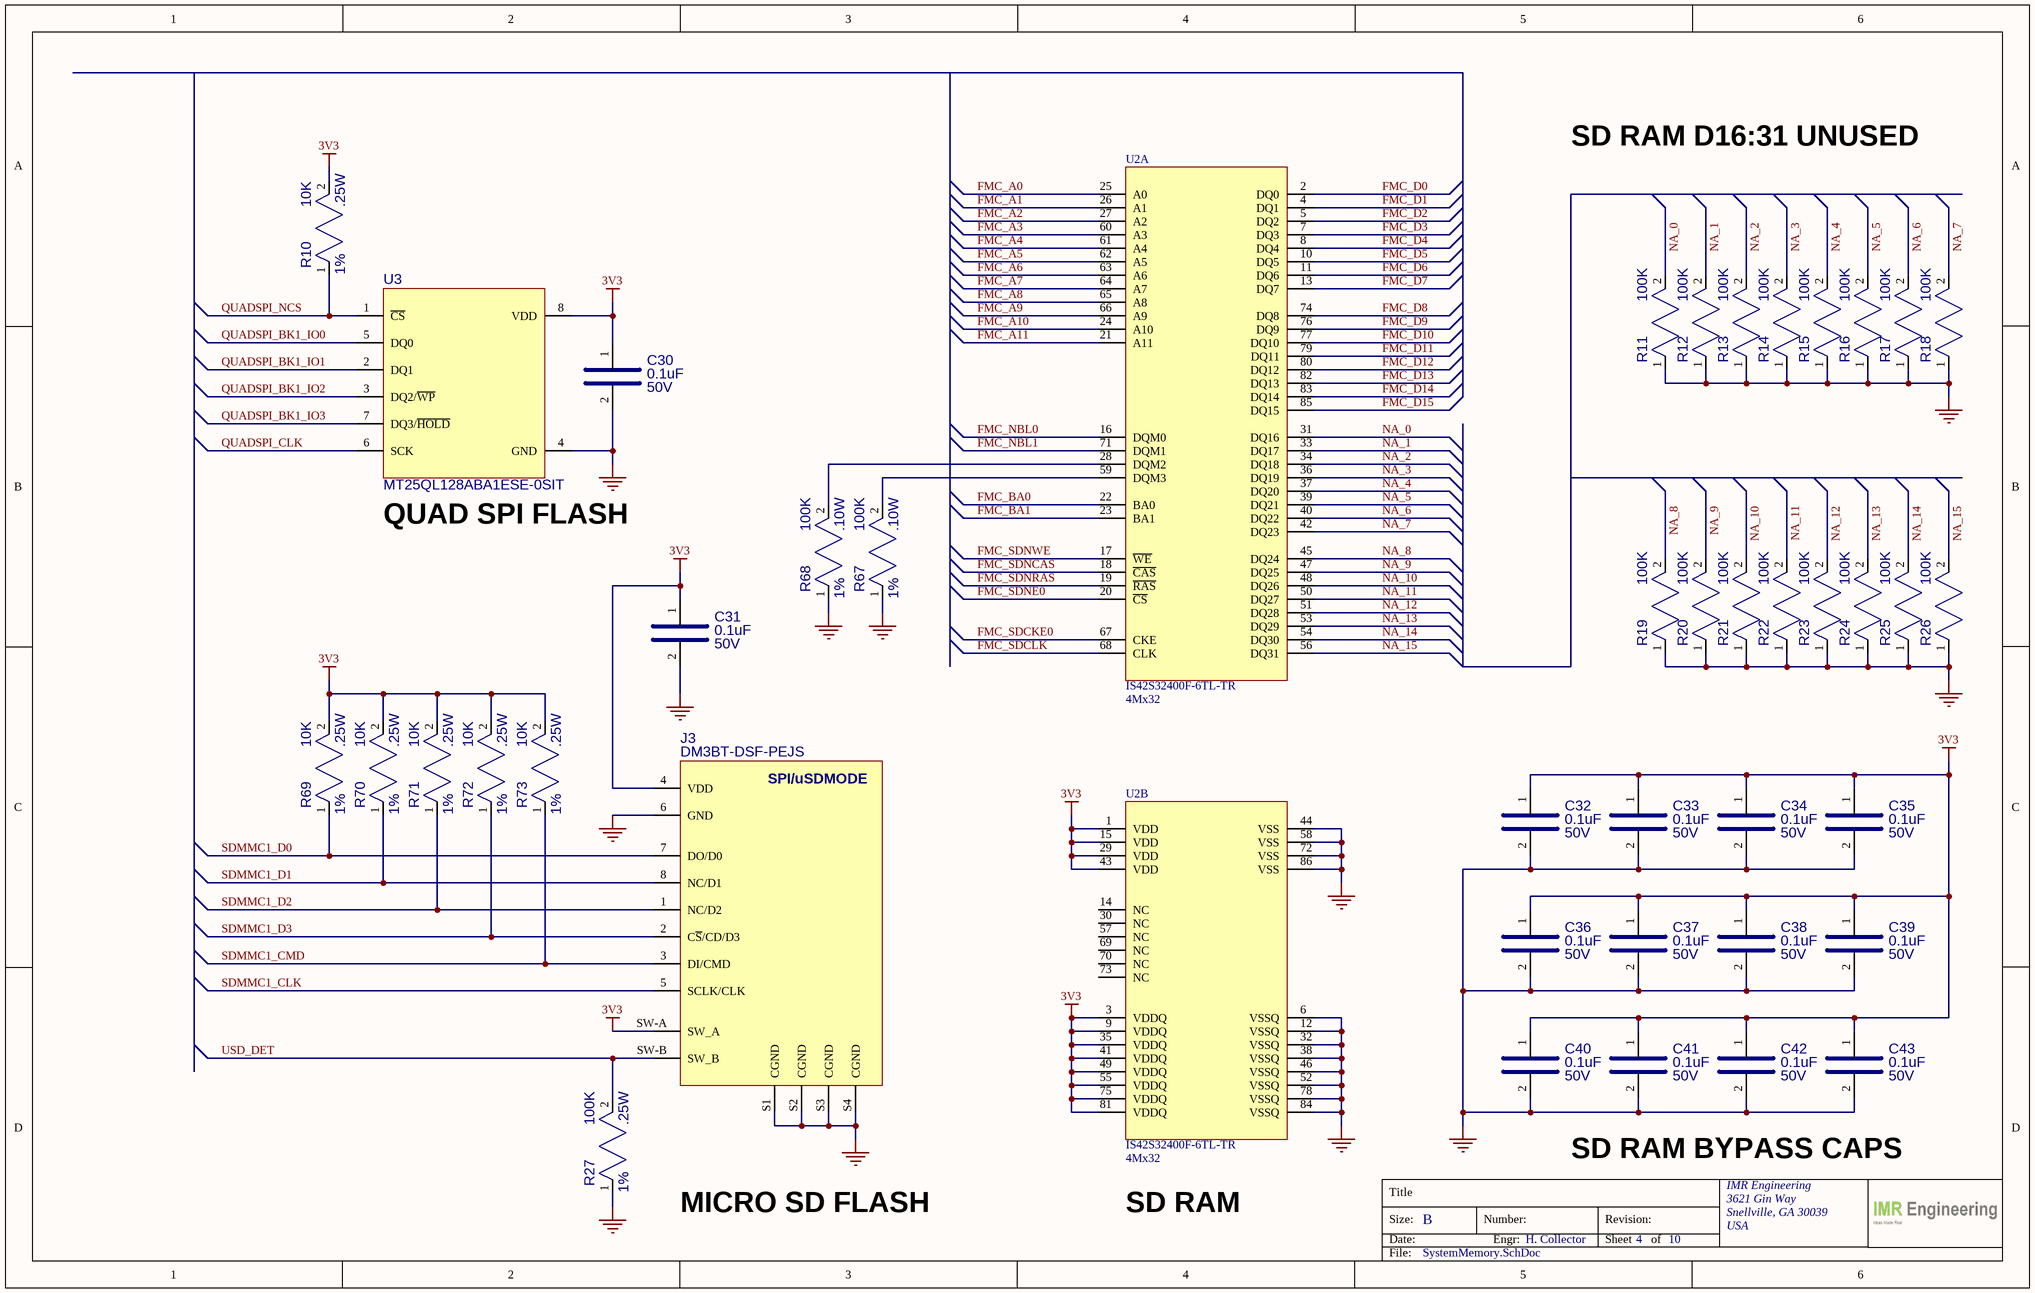
[diagram p3: SystemMemory.SchDoc]

### Parts
C30  value 0.1uF  VOLTAGE: 50V  [CAP_0805]  (hidden comment: 08055C104KAT2A)
C31  value 0.1uF  VOLTAGE: 50V  [CAP_0805]  (hidden comment: 08055C104KAT2A)
C32  value 0.1uF  VOLTAGE: 50V  [CAP_0603]  (hidden comment: CC0603KRX7R9BB104)
C33  value 0.1uF  VOLTAGE: 50V  [CAP_0603]  (hidden comment: CC0603KRX7R9BB104)
C34  value 0.1uF  VOLTAGE: 50V  [CAP_0603]  (hidden comment: CC0603KRX7R9BB104)
C35  value 0.1uF  VOLTAGE: 50V  [CAP_0603]  (hidden comment: CC0603KRX7R9BB104)
C36  value 0.1uF  VOLTAGE: 50V  [CAP_0603]  (hidden comment: CC0603KRX7R9BB104)
C37  value 0.1uF  VOLTAGE: 50V  [CAP_0603]  (hidden comment: CC0603KRX7R9BB104)
C38  value 0.1uF  VOLTAGE: 50V  [CAP_0603]  (hidden comment: CC0603KRX7R9BB104)
C39  value 0.1uF  VOLTAGE: 50V  [CAP_0603]  (hidden comment: CC0603KRX7R9BB104)
C40  value 0.1uF  VOLTAGE: 50V  [CAP_0603]  (hidden comment: CC0603KRX7R9BB104)
C41  value 0.1uF  VOLTAGE: 50V  [CAP_0603]  (hidden comment: CC0603KRX7R9BB104)
C42  value 0.1uF  VOLTAGE: 50V  [CAP_0603]  (hidden comment: CC0603KRX7R9BB104)
C43  value 0.1uF  VOLTAGE: 50V  [CAP_0603]  (hidden comment: CC0603KRX7R9BB104)
J3  DM3BT-DSF-PEJS  [HRS_DM3BT-DSF-PEJS]
R10  value 10K  TOLERANCE: 1%  POWER: .25W  [RES_0805]  (hidden comment: SG73S2ATTD1002F)
R11  value 100K  [RES_0603]  (hidden comment: RC0603FR-07100KL)
R12  value 100K  [RES_0603]  (hidden comment: RC0603FR-07100KL)
R13  value 100K  [RES_0603]  (hidden comment: RC0603FR-07100KL)
R14  value 100K  [RES_0603]  (hidden comment: RC0603FR-07100KL)
R15  value 100K  [RES_0603]  (hidden comment: RC0603FR-07100KL)
R16  value 100K  [RES_0603]  (hidden comment: RC0603FR-07100KL)
R17  value 100K  [RES_0603]  (hidden comment: RC0603FR-07100KL)
R18  value 100K  [RES_0603]  (hidden comment: RC0603FR-07100KL)
R19  value 100K  [RES_0603]  (hidden comment: RC0603FR-07100KL)
R20  value 100K  [RES_0603]  (hidden comment: RC0603FR-07100KL)
R21  value 100K  [RES_0603]  (hidden comment: RC0603FR-07100KL)
R22  value 100K  [RES_0603]  (hidden comment: RC0603FR-07100KL)
R23  value 100K  [RES_0603]  (hidden comment: RC0603FR-07100KL)
R24  value 100K  [RES_0603]  (hidden comment: RC0603FR-07100KL)
R25  value 100K  [RES_0603]  (hidden comment: RC0603FR-07100KL)
R26  value 100K  [RES_0603]  (hidden comment: RC0603FR-07100KL)
R27  value 100K  TOLERANCE: 1%  POWER: .25W  [PMG_RES_0805]  (hidden comment: RK73H2ATTD1003F)
R67  value 100K  TOLERANCE: 1%  POWER: .10W  [RES_0603]  (hidden comment: RC0603FR-07100KL)
R68  value 100K  TOLERANCE: 1%  POWER: .10W  [RES_0603]  (hidden comment: RC0603FR-07100KL)
R69  value 10K  TOLERANCE: 1%  POWER: .25W  [RES_0805]  (hidden comment: SG73S2ATTD1002F)
R70  value 10K  TOLERANCE: 1%  POWER: .25W  [RES_0805]  (hidden comment: SG73S2ATTD1002F)
R71  value 10K  TOLERANCE: 1%  POWER: .25W  [RES_0805]  (hidden comment: SG73S2ATTD1002F)
R72  value 10K  TOLERANCE: 1%  POWER: .25W  [RES_0805]  (hidden comment: SG73S2ATTD1002F)
R73  value 10K  TOLERANCE: 1%  POWER: .25W  [RES_0805]  (hidden comment: SG73S2ATTD1002F)
U2  IS42S32400F-6TL-TR  value 4Mx32  [86TSOPII]  (parts A,B of 2)
U3  MT25QL128ABA1ESE-0SIT  [SO8W]

### Nets
3V3: C30.1 C31.1 C32.1 C33.1 C34.1 C35.1 C36.1 C37.1 C38.1 C39.1 C40.1 C41.1 C42.1 C43.1 J3.4(VDD) J3.SW-A(SW_A) R10.2 R69.2 R70.2 R71.2 R72.2 R73.2 U2.1(VDD) U2.3(VDDQ) U2.9(VDDQ) U2.15(VDD) U2.29(VDD) U2.35(VDDQ) U2.41(VDDQ) U2.43(VDD) U2.49(VDDQ) U2.55(VDDQ) U2.75(VDDQ) U2.81(VDDQ) U3.8(VDD)
GND: C30.2 C31.2 C32.2 C33.2 C34.2 C35.2 C36.2 C37.2 C38.2 C39.2 C40.2 C41.2 C42.2 C43.2 J3.6(GND) J3.S1(CGND) J3.S2(CGND) J3.S3(CGND) J3.S4(CGND) R11.1 R12.1 R13.1 R14.1 R15.1 R16.1 R17.1 R18.1 R19.1 R20.1 R21.1 R22.1 R23.1 R24.1 R25.1 R26.1 R27.1 R67.1 R68.1 U2.6(VSSQ) U2.12(VSSQ) U2.32(VSSQ) U2.38(VSSQ) U2.44(VSS) U2.46(VSSQ) U2.52(VSSQ) U2.58(VSS) U2.72(VSS) U2.78(VSSQ) U2.84(VSSQ) U2.86(VSS) U3.4(GND)
FMC_A0: U2.25(A0)
FMC_A1: U2.26(A1)
FMC_A2: U2.27(A2)
FMC_A3: U2.60(A3)
FMC_A4: U2.61(A4)
FMC_A5: U2.62(A5)
FMC_A6: U2.63(A6)
FMC_A7: U2.64(A7)
FMC_A8: U2.65(A8)
FMC_A9: U2.66(A9)
FMC_A10: U2.24(A10)
FMC_A11: U2.21(A11)
FMC_BA0: U2.22(BA0)
FMC_BA1: U2.23(BA1)
FMC_D0: U2.2(DQ0)
FMC_D1: U2.4(DQ1)
FMC_D2: U2.5(DQ2)
FMC_D3: U2.7(DQ3)
FMC_D4: U2.8(DQ4)
FMC_D5: U2.10(DQ5)
FMC_D6: U2.11(DQ6)
FMC_D7: U2.13(DQ7)
FMC_D8: U2.74(DQ8)
FMC_D9: U2.76(DQ9)
FMC_D10: U2.77(DQ10)
FMC_D11: U2.79(DQ11)
FMC_D12: U2.80(DQ12)
FMC_D13: U2.82(DQ13)
FMC_D14: U2.83(DQ14)
FMC_D15: U2.85(DQ15)
FMC_NBL0: U2.16(DQM0)
FMC_NBL1: U2.71(DQM1)
FMC_SDCKE0: U2.67(CKE)
FMC_SDCLK: U2.68(CLK)
FMC_SDNCAS: U2.18(~{CAS})
FMC_SDNE0: U2.20(~{CS})
FMC_SDNRAS: U2.19(~{RAS})
FMC_SDNWE: U2.17(~{WE})
NA_0: R11.2 U2.31(DQ16)
NA_1: R12.2 U2.33(DQ17)
NA_2: R13.2 U2.34(DQ18)
NA_3: R14.2 U2.36(DQ19)
NA_4: R15.2 U2.37(DQ20)
NA_5: R16.2 U2.39(DQ21)
NA_6: R17.2 U2.40(DQ22)
NA_7: R18.2 U2.42(DQ23)
NA_8: R19.2 U2.45(DQ24)
NA_9: R20.2 U2.47(DQ25)
NA_10: R21.2 U2.48(DQ26)
NA_11: R22.2 U2.50(DQ27)
NA_12: R23.2 U2.51(DQ28)
NA_13: R24.2 U2.53(DQ29)
NA_14: R25.2 U2.54(DQ30)
NA_15: R26.2 U2.56(DQ31)
QUADSPI_BK1_IO0: U3.5(DQ0)
QUADSPI_BK1_IO1: U3.2(DQ1)
QUADSPI_BK1_IO2: U3.3(DQ2/~{WP})
QUADSPI_BK1_IO3: U3.7(DQ3/~{HOLD})
QUADSPI_CLK: U3.6(SCK)
QUADSPI_NCS: R10.1 U3.1(~{CS})
SDMMC1_CLK: J3.5(SCLK/CLK)
SDMMC1_CMD: J3.3(DI/CMD) R73.1
SDMMC1_D0: J3.7(DO/D0) R69.1
SDMMC1_D1: J3.8(NC/D1) R70.1
SDMMC1_D2: J3.1(NC/D2) R71.1
SDMMC1_D3: J3.2(C~{S}/CD/D3) R72.1
USD_DET: J3.SW-B(SW_B) R27.2
NetR67_2: R67.2 U2.59(DQM3)
NetR68_2: R68.2 U2.28(DQM2)

Not connected (* = marked no-connect by the designer): U2 14(NC) 30(NC) 57(NC) 69(NC) 70(NC) 73(NC)

### Notes on the sheet
- SD RAM D16:31 UNUSED
- (near U3) QUAD SPI FLASH
- SD RAM BYPASS CAPS
- MICRO SD FLASH
- SD RAM
- Title
- Size:
- Date:
- B
- Number:
- Engr:
- Revision:
- Sheet
- of
- File:
- (in symbol CONN_HIROSE_DM3BT-DSF-PEJS) SPI/uSDMODE

### Library data of the parts
C30 C31 = CAP_0.1UF_50V_0805: as C81 on sheet MainControllerPower; MFG_PN: 08055C104KAT2A; Supplier 1: Digi-Key; Supplier Part Number 1: 478-1395-1-ND; Case/Package: 0805
  C30: ClassName: Memory_Quad_SPI_Flash
  C31: ClassName: Memory_MicroSD
C32-C43 = CAP_0.1UF_50V_0603: as C6 on sheet MainController; MFG_PN: CC0603KRX7R9BB104; Supplier 1: Digi-Key; Supplier Part Number 1: 311-1344-1-ND; Case/Package: 0603; ClassName: Memory_SDRAM
J3 = CONN_HIROSE_DM3BT-DSF-PEJS: CONN MICRO SD CARD PUSH-PUSH R/A; MFG: Hirose Electric Co Ltd; MFG_PN: DM3BT-DSF-PEJS; Supplier 1: Digi-Key; Supplier Part Number 1: HR1942CT-ND; VALUE: DM3BT-DSF-PEJS; ClassName: Memory_MicroSD
R10 R69-R73 = RES_10K_0805_1/4W_1%: as R9 on sheet MainControllerPower; Case/Package: 0805; MFG_PN: SG73S2ATTD1002F; Supplier 1: Digi-Key; Supplier Part Number 1: 2019-SG73S2ATTD1002FCT-ND
  R69-R73: ClassName: Memory_MicroSD
R11-R26 = RES_100K_0603_1/10W_1%: RES SMD 100K OHM 1% 1/10W 0603; MFG: Yageo; POWER: .10W; Case/Package: 0603; MFG_PN: RC0603FR-07100KL; Supplier 1: Digi-Key; Supplier Part Number 1: 311-100KHRCT-ND; TOLERANCE: 1%
R27 = RES_100K_0805_1/4W_1%: RES SMD 100K OHM 1% 1/4W 0805; MFG: KOA Speer Electronics, Inc.; Case/Package: 0805; MFG_PN: RK73H2ATTD1003F; Supplier 1: Digi-Key; Supplier Part Number 1: 2019-RK73H2ATTD1003FCT-ND; ClassName: Memory_MicroSD
R67 R68 = RES_100K_0603_1/10W_1%: as R6 on sheet MainController; Case/Package: 0603; MFG_PN: RC0603FR-07100KL; Supplier 1: Digi-Key; Supplier Part Number 1: 311-100KHRCT-ND
U2 = IC_ IS42S32400F-6TL: IC DRAM 128M PARALLEL 86TSOP II; MFG: ISSI, Integrated Silicon Solution Inc; MFG_PN: IS42S32400F-6TL-TR; Supplier 1: Mouser; Supplier Part Number 1: 870-IS42S32400F-6TL; Case/Package: 86TSSOPII; ClassName: Memory_SDRAM
U3 = IC_MT25QL128ABA1ESE-0SIT: IC FLASH 128M SPI 133MHZ 8SOP2; MFG: Micron Technology Inc.; MFG_PN: MT25QL128ABA1ESE-0SIT; Supplier 1: Digi-Key; Supplier Part Number 1: 557-1772-1-ND; Case/Package: 8SOP2; VALUE: MT25QL128ABA1ESE-0SIT; ClassName: Memory_Quad_SPI_Flash

## Sheet LCD_TouchBackLight.SchDoc: =ProjectTitle
size B; Date: 10/29/2020; Engineer: H. Collector; Organization: IMR Engineering; Address1: 3621 Gin Way; Address2: Snellville, GA 30039; Address3: USA; DocumentNumber: IMR_002; Revision: 1; SheetNumber: 5; SheetTotal: 10
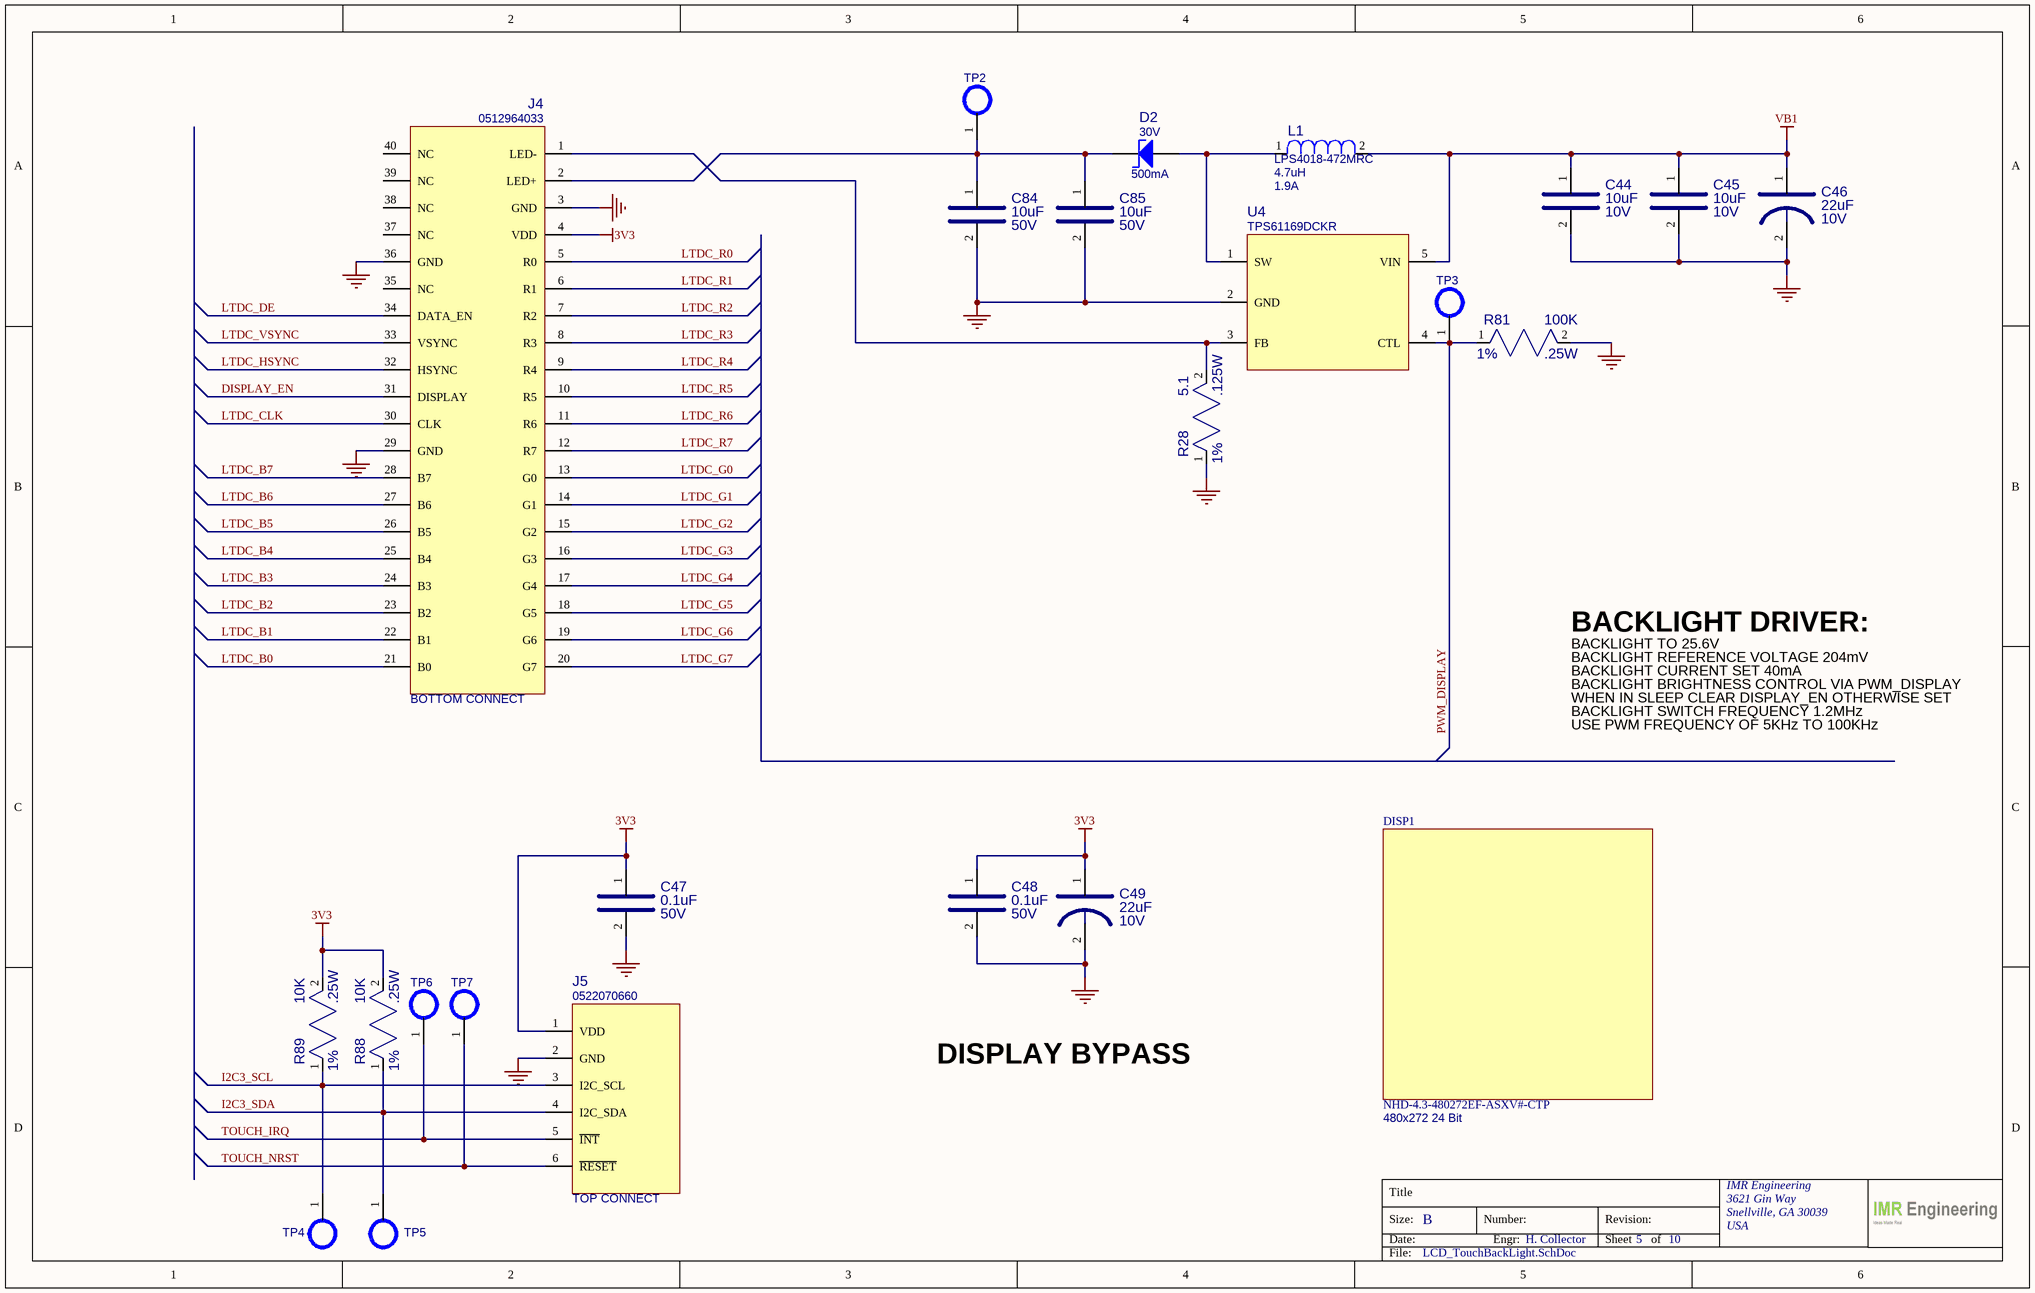
[diagram p4: LCD_TouchBackLight.SchDoc]

### Parts
C44  value 10uF  VOLTAGE: 10V  [CAP_0805]  (hidden comment: C2012X7R1A106K125AC)
C45  value 10uF  VOLTAGE: 10V  [CAP_0805]  (hidden comment: C2012X7R1A106K125AC)
C46  value 22uF  VOLTAGE: 10V  [CAP_1206_TANT]  (hidden comment: TAJA226M010RNJ)
C47  value 0.1uF  VOLTAGE: 50V  [CAP_0805]  (hidden comment: 08055C104KAT2A)
C48  value 0.1uF  VOLTAGE: 50V  [CAP_0805]  (hidden comment: 08055C104KAT2A)
C49  value 22uF  VOLTAGE: 10V  [CAP_1206_TANT]  (hidden comment: TAJA226M010RNJ)
C84  value 10uF  VOLTAGE: 50V  [CAP_1206]  (hidden comment: CL31A106KBHNNNE)
C85  value 10uF  VOLTAGE: 50V  [CAP_1206]  (hidden comment: CL31A106KBHNNNE)
D2  value 30V  Current: 500mA  [SOD123]  (hidden comment: PMEG3005EGWJ)
DISP1  NHD-4.3-480272EF-ASXV#-CTP  value 480x272 24 Bit  [NHD_NHD-4.3-480272EF-ASXV#-CTP]
J4  0512964033  value BOTTOM CONNECT  [CONN_MOLEX_0512964033]
J5  0522070660  value TOP CONNECT  [CONN_MOLEX_0522070660]
L1  value 4.7uH  Current: 1.9A  [LPS4018]  (hidden comment: LPS4018-472MRC)
R28  value 5.1  TOLERANCE: 1%  POWER: .125W  [PMG_RES_0805]  (hidden comment: RC0805FR-075R1L)
R81  value 100K  TOLERANCE: 1%  POWER: .25W  [PMG_RES_0805]  (hidden comment: RK73H2ATTD1003F)
R88  value 10K  TOLERANCE: 1%  POWER: .25W  [RES_0805]  (hidden comment: SG73S2ATTD1002F)
R89  value 10K  TOLERANCE: 1%  POWER: .25W  [RES_0805]  (hidden comment: SG73S2ATTD1002F)
TP2  TP_0635MM_HOLE  [TP_0635MM_HOLE]  (value not drawn)  (no BOM)
TP3  TP_0635MM_HOLE  [TP_0635MM_HOLE]  (value not drawn)  (no BOM)
TP4  TP_0635MM_HOLE  [TP_0635MM_HOLE]  (value not drawn)  (no BOM)
TP5  TP_0635MM_HOLE  [TP_0635MM_HOLE]  (value not drawn)  (no BOM)
TP6  TP_0635MM_HOLE  [TP_0635MM_HOLE]  (value not drawn)  (no BOM)
TP7  TP_0635MM_HOLE  [TP_0635MM_HOLE]  (value not drawn)  (no BOM)
U4  TPS61169DCKR  [SC70-5_SOT-353_5-TSSOP]

### Nets
3V3: C47.1 C48.1 C49.1 J4.4(VDD) J5.1(VDD) R88.2 R89.2
GND: C44.2 C45.2 C46.2 C47.2 C48.2 C49.2 C84.2 C85.2 J4.3(GND) J4.29(GND) J4.36(GND) J5.2(GND) R28.1 R81.2 U4.2(GND)
VB1: C44.1 C45.1 C46.1 L1.2 U4.5(VIN)
DISPLAY_EN: J4.31(DISPLAY)
I2C3_SCL: J5.3(I2C_SCL) R89.1 TP4.1
I2C3_SDA: J5.4(I2C_SDA) R88.1 TP5.1
LTDC_B0: J4.21(B0)
LTDC_B1: J4.22(B1)
LTDC_B2: J4.23(B2)
LTDC_B3: J4.24(B3)
LTDC_B4: J4.25(B4)
LTDC_B5: J4.26(B5)
LTDC_B6: J4.27(B6)
LTDC_B7: J4.28(B7)
LTDC_CLK: J4.30(CLK)
LTDC_DE: J4.34(DATA_EN)
LTDC_G0: J4.13(G0)
LTDC_G1: J4.14(G1)
LTDC_G2: J4.15(G2)
LTDC_G3: J4.16(G3)
LTDC_G4: J4.17(G4)
LTDC_G5: J4.18(G5)
LTDC_G6: J4.19(G6)
LTDC_G7: J4.20(G7)
LTDC_HSYNC: J4.32(HSYNC)
LTDC_R0: J4.5(R0)
LTDC_R1: J4.6(R1)
LTDC_R2: J4.7(R2)
LTDC_R3: J4.8(R3)
LTDC_R4: J4.9(R4)
LTDC_R5: J4.10(R5)
LTDC_R6: J4.11(R6)
LTDC_R7: J4.12(R7)
LTDC_VSYNC: J4.33(VSYNC)
PWM_DISPLAY: R81.1 TP3.1 U4.4(CTL)
TOUCH_IRQ: J5.5(~{INT}) TP6.1
TOUCH_NRST: J5.6(~{RESET}) TP7.1
NetC84_1: C84.1 C85.1 D2.2(K) J4.2(LED+) TP2.1
NetD2_1: D2.1(A) L1.1 U4.1(SW)
NetJ4_1: J4.1(LED-) R28.2 U4.3(FB)

Not connected (* = marked no-connect by the designer): J4 35(NC) 37(NC) 38(NC) 39(NC) 40(NC)

### Notes on the sheet
- BACKLIGHT DRIVER:
- BACKLIGHT TO 25.6V
- BACKLIGHT CURRENT SET 40mA
- BACKLIGHT BRIGHTNESS CONTROL VIA PWM_DISPLAY
- WHEN IN SLEEP CLEAR DISPLAY_EN OTHERWISE SET
- BACKLIGHT REFERENCE VOLTAGE 204mV
- BACKLIGHT SWITCH FREQUENCY 1.2MHz
- USE PWM FREQUENCY OF 5KHz TO 100KHz
- DISPLAY BYPASS
- Title
- Size:
- Date:
- B
- Number:
- Engr:
- Revision:
- Sheet
- of
- File:

### Library data of the parts
C44 C45 = CAP_10UF_10V_0805: CAP CER 10UF 10V X7R 0805; MFG: TDK Corporation; TOLERANCE: 10%; MFG_PN: C2012X7R1A106K125AC; Supplier 1: Digi-Key; Supplier Part Number 1: 445-6857-1-ND; Case/Package: 0805; ClassName: Display_BacklightDriver
C46 C49 = CAP_22UF_10V_TANT: CAP TANT 22UF 20% 10V 1206; MFG: AVX Corporation; TOLERANCE: 10%; MFG_PN: TAJA226M010RNJ; Supplier 1: Digi-Key; Supplier Part Number 1: 478-5798-1-ND
  C46: ClassName: Display_BacklightDriver
C47 C48 = CAP_0.1UF_50V_0805: as C81 on sheet MainControllerPower; MFG_PN: 08055C104KAT2A; Supplier 1: Digi-Key; Supplier Part Number 1: 478-1395-1-ND; Case/Package: 0805
  C48: ClassName: Display_BacklightDriver
C84 C85 = CAP_10UF_50V_1206: CAP CER 10UF 50V X5R 1206; MFG: Samsung Electro-Mechanics; TOLERANCE: 10%; MFG_PN: CL31A106KBHNNNE; Supplier 1: Digi-Key; Supplier Part Number 1: 1276-2876-1-ND; Case/Package: 0805; ClassName: Display_BacklightDriver
D2 = DIODE_SCHOTTKY_PMEG3005EGWJ: DIODE SCHOTTKY 30V 500MA SOD123; MFG: Nexperia USA Inc.; ComponentLink1Description: Manufacturer Link; ComponentLink1URL: http://www.fairchildsemi.com/; ComponentLink2Description: Datasheet; ComponentLink2URL: http://www.fairchildsemi.com/ds/1N%2F1N4148.pdf; Supplier 1: Digi-Key; Supplier Part Number 1: MBRS2040LT3GOSCT-ND; MFG_PN: PMEG3005EGWJ; Case/Package: SOD-123; ClassName: Display_BacklightDriver
DISP1 = MODULE_NHD-4.3-480272EF-ASXV#-CTP: LCD TFT 480X272 HIGH BRIGHT; MFG: Newhaven Display Intl; MFG_PN: NHD-4.3-480272EF-ASXV#-CTP; Supplier Part Number 1: NHD-4.3-480272EF-ASXV#-CTP-ND; Supplier 1: DigiKey; ClassName: Display_Connector
J4 = CONN_MOLEX_0512964033: CONN FFC BOTTOM 40POS 0.50MM R/A; MFG: Molex; Case/Package: 0512964033; Supplier 1: Digi-Key; Supplier Part Number 1: WM11237CT-ND; MFG_PN: 0512964033; ClassName: Display_Connector
J5 = CONN_MOLEX_0522070660: CONN FPC TOP 6POS 1.00MM R/A; MFG: Molex; Case/Package: 0522070660; Supplier 1: Digi-Key; Supplier Part Number 1: WM10939CT-ND; MFG_PN: 0522070660; ClassName: Display_Connector
L1 = INDUCTOR_LPS4018-472MRC: SHIELDED POWER INDUCTORS, 4.7UH; MFG: COILCRAFT; TOLERANCE: 20%; Supplier 1: Digi-Key; Supplier Part Number 1: 2457-LPS4018-472MRC-ND; MFG_PN: LPS4018-472MRC; ClassName: Display_BacklightDriver
R28 = RES_5.1_0805_1/8W_1%: RES 5.1 OHM 1% 1/8W 0805; MFG: Yageo; Case/Package: 0805; MFG_PN: RC0805FR-075R1L; Supplier 1: Digi-Key; Supplier Part Number 1: YAG3373CT-ND; ClassName: Display_BacklightDriver
R81 = RES_100K_0805_1/4W_1%: as R27 on sheet SystemMemory; Case/Package: 0805; MFG_PN: RK73H2ATTD1003F; Supplier 1: Digi-Key; Supplier Part Number 1: 2019-RK73H2ATTD1003FCT-ND; ClassName: Display_BacklightDriver
R88 R89 = RES_10K_0805_1/4W_1%: as R9 on sheet MainControllerPower; Case/Package: 0805; MFG_PN: SG73S2ATTD1002F; Supplier 1: Digi-Key; Supplier Part Number 1: 2019-SG73S2ATTD1002FCT-ND; ClassName: Display_Connector
TP2-TP7 = TP_0635MM_HOLE: 3MM IN D. MT HOLE
U4 = IC_TPS61169DCKR: IC LED DRVR RGLTR DIM 1.8A SC70; MFG: Texas Instruments; Supplier 1: Digi-Key; Supplier Part Number 1: 296-40821-1-ND; VALUE: 1.8A; Case/Package: SC70; MFG_PN: TPS61169DCKR; ClassName: Display_BacklightDriver

## Sheet SerialInterface.SchDoc: =ProjectTitle
size B; Date: 10/29/2020; Engineer: H. Collector; Organization: IMR Engineering; Address1: 3621 Gin Way; Address2: Snellville, GA 30039; Address3: USA; DocumentNumber: IMR_002; Revision: 1; SheetNumber: 6; SheetTotal: 10
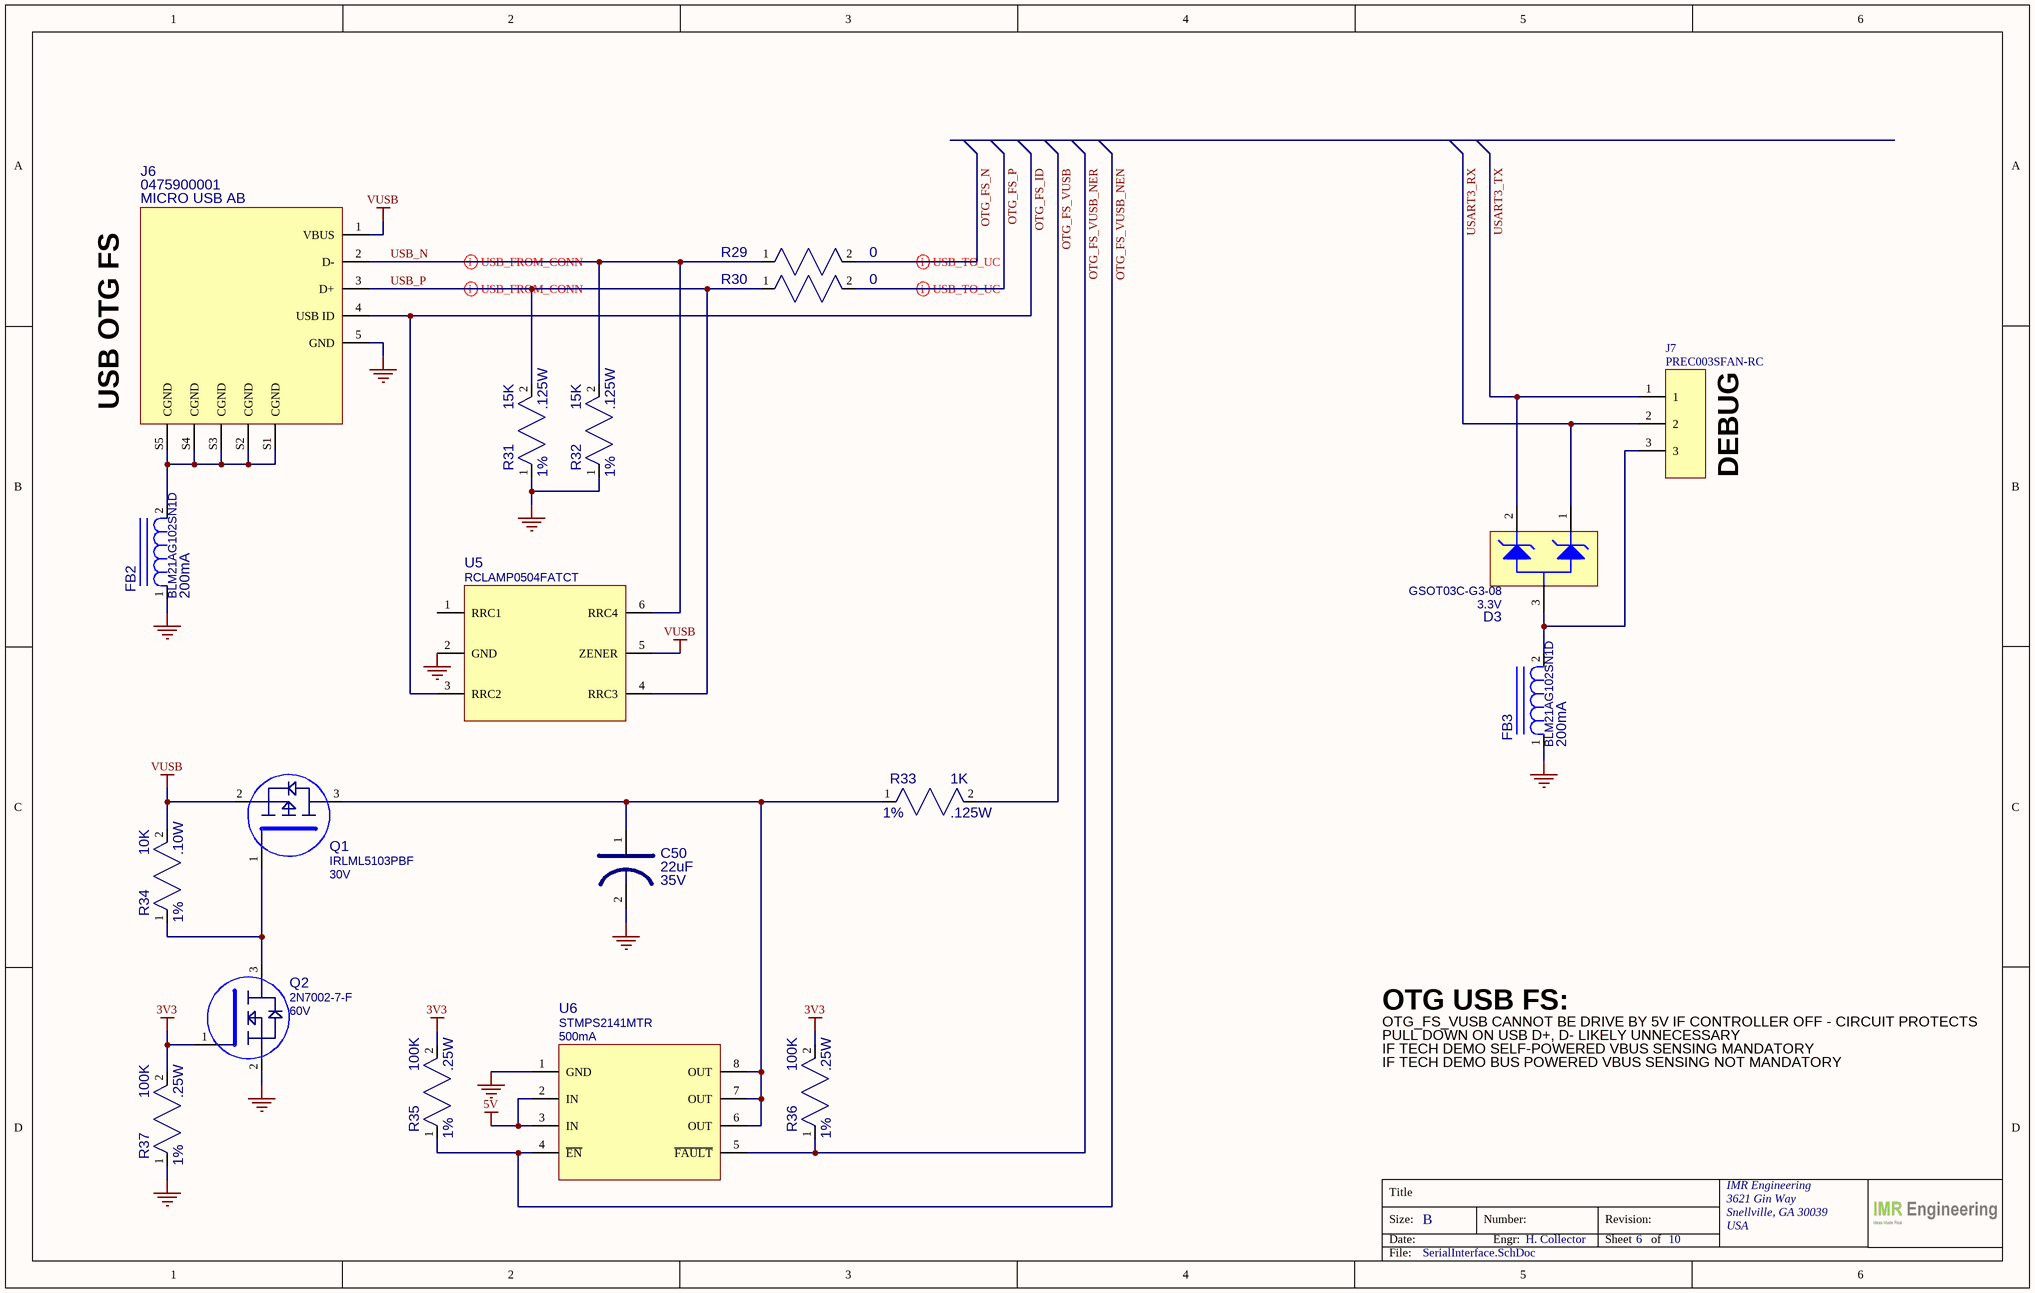
[diagram p5: SerialInterface.SchDoc]

### Parts
C50  value 22uF  VOLTAGE: 35V  [CAP_ALE_SMD_6.6x6.6]  (hidden comment: UZS1C220MCL1GB)
D3  value 3.3V  [SOT-23]  (hidden comment: GSOT03C-G3-08)
FB2  value 200mA  [RES_0805]  (hidden comment: BLM21AG102SN1D)
FB3  value 200mA  [RES_0805]  (hidden comment: BLM21AG102SN1D)
J6  value MICRO USB AB  [MICRO_USB_AB_MOLEX_0475900001]  (hidden comment: 0475900001)
J7  PREC003SFAN-RC  [HDR_1X3_100MILL]
Q1  value 30V  [SOT-23]  (hidden comment: IRLML5103PBF)
Q2  value 60V  [SOT-23]  (hidden comment: 2N7002-7-F)
R29  value 0  [PMG_RES_0805]  (hidden comment: RC0805JR-070RL)
R30  value 0  [PMG_RES_0805]  (hidden comment: RC0805JR-070RL)
R31  value 15K  TOLERANCE: 1%  POWER: .125W  [RES_0805]  (hidden comment: RC0805FR-0715KL)
R32  value 15K  TOLERANCE: 1%  POWER: .125W  [RES_0805]  (hidden comment: RC0805FR-0715KL)
R33  value 1K  TOLERANCE: 1%  POWER: .125W  [RES_0805]  (hidden comment: RC0805FR-071KL)
R34  value 10K  TOLERANCE: 1%  POWER: .10W  [RES_0603]  (hidden comment: RC0603FR-0710KL)
R35  value 100K  TOLERANCE: 1%  POWER: .25W  [PMG_RES_0805]  (hidden comment: RK73H2ATTD1003F)
R36  value 100K  TOLERANCE: 1%  POWER: .25W  [PMG_RES_0805]  (hidden comment: RK73H2ATTD1003F)
R37  value 100K  TOLERANCE: 1%  POWER: .25W  [PMG_RES_0805]  (hidden comment: RK73H2ATTD1003F)
U5  RCLAMP0504FATCT  [SOT-363_6-TSSOP_SC-88]
U6  value 500mA  [SO-8]  (hidden comment: STMPS2141MTR)

### Nets
3V3: Q2.1(B) R35.2 R36.2 R37.2
5V: U6.2(IN) U6.3(IN)
GND: C50.2 FB2.1 FB3.1 J6.5(GND) Q2.2(E) R31.1 R32.1 R37.1 U5.2(GND) U6.1(GND)
VUSB: J6.1(VBUS) Q1.2(E) R34.2 U5.5(ZENER)
OTG_FS_ID: J6.4(USB_ID) U5.3(RRC2)
OTG_FS_N: R29.2
OTG_FS_P: R30.2
OTG_FS_VUSB: R33.2
OTG_FS_VUSB_NEN: R35.1 U6.4(~{EN})
OTG_FS_VUSB_NER: R36.1 U6.5(~{FAULT})
USART3_RX: D3.1(A1) J7.2
USART3_TX: D3.2(A2) J7.1
USB_N: J6.2(D-) R29.1 R32.2 U5.6(RRC4)
USB_P: J6.3(D+) R30.1 R31.2 U5.4(RRC3)
NetC50_1: C50.1 Q1.3(C) R33.1 U6.6(OUT) U6.7(OUT) U6.8(OUT)
NetD3_3: D3.3(A) FB3.2 J7.3
NetFB2_2: FB2.2 J6.S1(CGND) J6.S2(CGND) J6.S3(CGND) J6.S4(CGND) J6.S5(CGND)
NetQ1_1: Q1.1(B) Q2.3(C) R34.1

Not connected (* = marked no-connect by the designer): U5 1(RRC1)

### Layout directives
differential pair: OTG_FS_N, OTG_FS_P, USB_N, USB_P

### Notes on the sheet
- (near J6) USB OTG FS
- (near J7) DEBUG
- OTG USB FS:
- OTG_FS_VUSB CANNOT BE DRIVE BY 5V IF CONTROLLER OFF - CIRCUIT PROTECTS
- PULL DOWN ON USB D+, D- LIKELY UNNECESSARY
- IF TECH DEMO SELF-POWERED VBUS SENSING MANDATORY
- IF TECH DEMO BUS POWERED VBUS SENSING NOT MANDATORY
- Title
- Size:
- Date:
- B
- Number:
- Engr:
- Revision:
- Sheet
- of
- File:

### Library data of the parts
C50 = CAP_22UF_35V_ALE_NF: CAP, AL E, 22UF, 35V, 20%, ROHS; MFG: NICHICON; MFG_PN: UZS1C220MCL1GB; TOLERANCE: 20%; Supplier 1: Digi-Key; Supplier Part Number 1: 493-10138-1-ND
D3 = DIODE_TVS_GSOT03C-G3-08: TVS DIODE 3.3V 12.3V SOT23; MFG: Vishay Semiconductor; POWER: 30A (8/20us); Case/Package: SOT-23; Supplier 1: Digi-Key; Supplier Part Number 1: GSOT03C-G3-08GICT-ND; MFG_PN: GSOT03C-G3-08; ClassName: Serial_DebugPort
FB2 FB3 = FERRITE_BLM21AG102SN1D: as FB1 on sheet MainControllerPower; Supplier 1: Digi-Key; Supplier Part Number 1: 490-1041-1-ND; MFG_PN: BLM21AG102SN1D
  FB2: ClassName: Serial_USB_FS
  FB3: ClassName: Serial_DebugPort
J6 = CONN_USB_MOLEX_0475900001: CONN RCPT MICRO USB AB 5P SMD RA; MFG: Molex; Supplier 1: Digi-Key; Supplier Part Number 1: WM17144CT-ND; MFG_PN: 0475900001; ClassName: Serial_USB_FS
J7 = CONN_3P_SINGLE_ROW: CONN HEADER VERT 3POS 2.54MM; MFG: Sullins Connector Solutions; Case/Package: 3P_2.54MM; MFG_PN: PREC003SFAN-RC; Supplier 1: Digi-Key; Supplier Part Number 1: S1212EC-03-ND; Value: *; ClassName: Serial_DebugPort
Q1 = MOSFET_PCH_IRLML5103PBF: MOSFET P CHN, VDS=30V, RDSON = .6OHM, SOT 23; MFG: INTERNATIONAL RECTIFIER; ComponentLink1Description: Manufacturer Link; ComponentLink1URL: http://www.fairchildsemi.com/; ComponentLink2Description: Datasheet; ComponentLink2URL: http://www.fairchildsemi.com/ds/2N%2F2N3904.pdf; Supplier 1: Digi-Key; MFG_PN: IRLML5103PBF; Supplier Part Number 1: IRLML5103PBFCT-ND; ClassName: Serial_USB_FS
Q2 = MOSFET_NCH_2N7002-7-F: MOSFET N-CH 60V 115MA SOT23-3; MFG: Diodes Incorporated; Case/Package: SOT-23; Supplier 1: Digi-Key; Supplier Part Number 1: 2N7002-FDICT-ND; MFG_PN: 2N7002-7-F; ClassName: Serial_USB_FS
R29 R30 = RES_0_0805_1/8W: RES SMD 0 OHM JUMPER 1/8W 0805; MFG: Yageo; POWER: .125W; Case/Package: 0805; MFG_PN: RC0805JR-070RL; Supplier 1: Digi-Key; Supplier Part Number 1: 311-0.0ARCT-ND; TOLERANCE: JUMPER; ClassName: Serial_USB_FS
R31 R32 = RES_15K_0805_1/8W_1%: RES SMD 15K OHM 1% 1/8W 0805; MFG: Yageo; Case/Package: 0805; MFG_PN: RC0805FR-0715KL; Supplier 1: Digi-Key; Supplier Part Number 1: 311-15.0KCRCT-ND; ClassName: Serial_USB_FS
R33 = RES_1K_0805_1/8W_1%: RES SMD 1K OHM 1% 1/8W 0805; MFG: Yageo; Case/Package: 0805; MFG_PN: RC0805FR-071KL; Supplier 1: Digi-Key; Supplier Part Number 1: 311-1.00KCRCT-ND; ClassName: Serial_USB_FS
R34 = RES_10K_0603_1/10W_1%: as R4 on sheet MainController; Case/Package: 0603; MFG_PN: RC0603FR-0710KL; Supplier 1: Digi-Key; Supplier Part Number 1: 311-10.0KHRCT-ND; ClassName: Serial_USB_FS
R35-R37 = RES_100K_0805_1/4W_1%: as R27 on sheet SystemMemory; Case/Package: 0805; MFG_PN: RK73H2ATTD1003F; Supplier 1: Digi-Key; Supplier Part Number 1: 2019-RK73H2ATTD1003FCT-ND; ClassName: Serial_USB_FS
U5 = IC_RCLAMP0504FATCT: TVS DIODE 5V 25V SC70-6; MFG: Semtech Corporation; Supplier 1: Digi-Key; Supplier Part Number 1: RCLAMP0504FATCTCT-ND; VALUE: 5V; MFG_PN: RCLAMP0504FATCT; ClassName: Serial_USB_FS
U6 = IC_STMPS2141MTR: IC PWR SWITCH N-CHANNEL 1:1 8SO; MFG: STMicroelectronics; Supplier 1: Digi-Key; Supplier Part Number 1: 497-6932-1-ND; Case/Package: SO8; MFG_PN: STMPS2141MTR; ClassName: Serial_USB_FS

## Sheet UserInteractive.SchDoc: =ProjectTitle
size B; Date: 10/29/2020; Engineer: H. Collector; Organization: IMR Engineering; Address1: 3621 Gin Way; Address2: Snellville, GA 30039; Address3: USA; DocumentNumber: IMR_002; Revision: 1; SheetNumber: 7; SheetTotal: 10
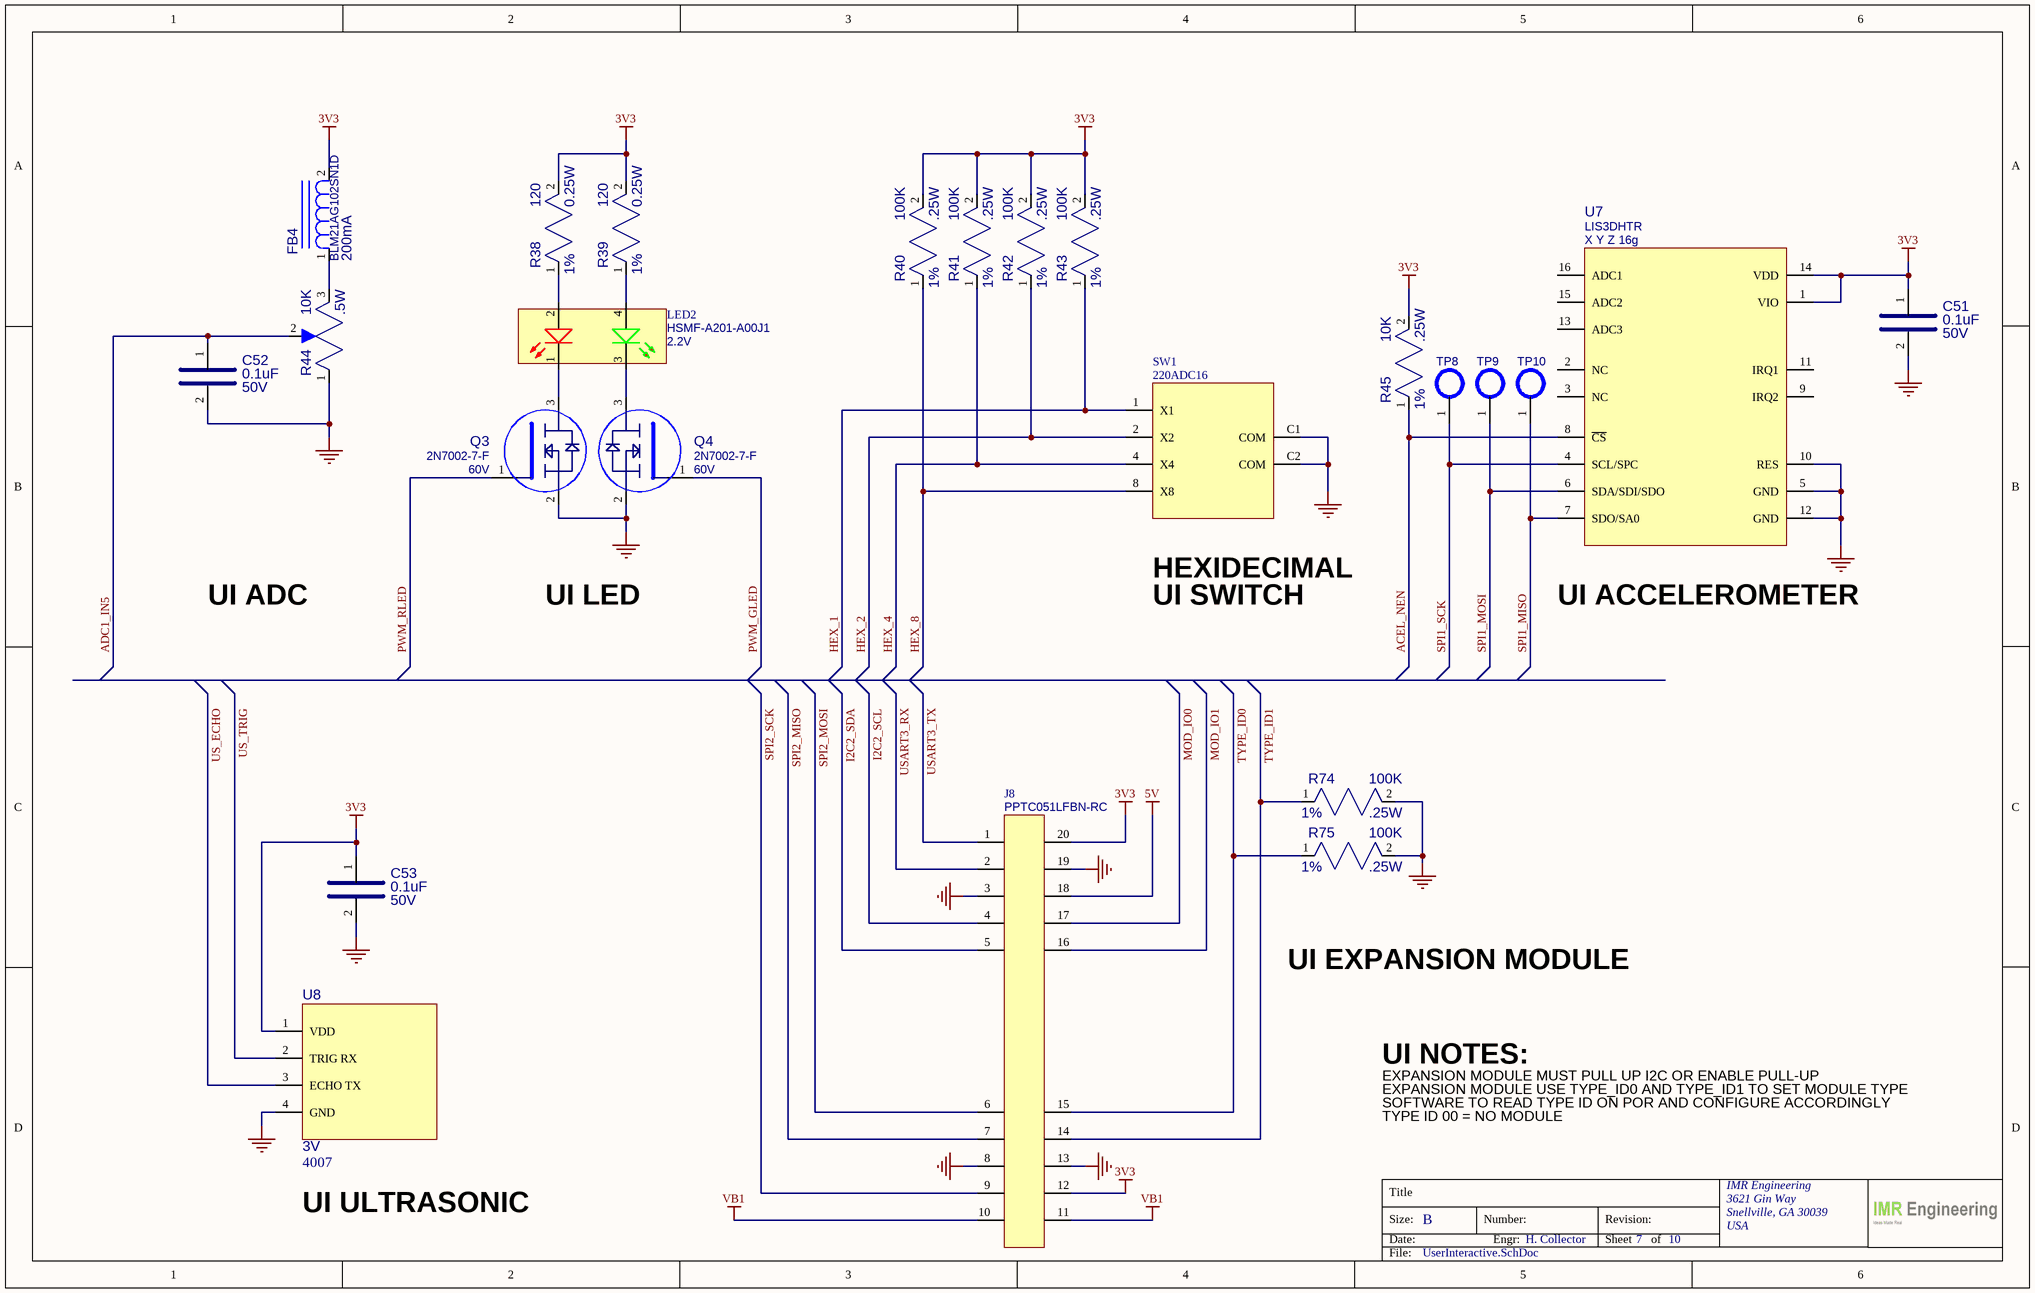
[diagram p6: UserInteractive.SchDoc]

### Parts
C51  value 0.1uF  VOLTAGE: 50V  [CAP_0805]  (hidden comment: 08055C104KAT2A)
C52  value 0.1uF  VOLTAGE: 50V  [CAP_0805]  (hidden comment: 08055C104KAT2A)
C53  value 0.1uF  VOLTAGE: 50V  [CAP_0805]  (hidden comment: 08055C104KAT2A)
FB4  value 200mA  [RES_0805]  (hidden comment: BLM21AG102SN1D)
J8  PPTC051LFBN-RC  [CONN_EXPANSION_BOARD]
LED2  value 2.2V  [4PLCC-LED]  (hidden comment: HSMF-A201-A00J1)
Q3  value 60V  [SOT-23]  (hidden comment: 2N7002-7-F)
Q4  value 60V  [SOT-23]  (hidden comment: 2N7002-7-F)
R38  value 120  TOLERANCE: 1%  POWER: 0.25W  [PMG_RES_0805]  (hidden comment: RK73H2ATTD1200F)
R39  value 120  TOLERANCE: 1%  POWER: 0.25W  [PMG_RES_0805]  (hidden comment: RK73H2ATTD1200F)
R40  value 100K  TOLERANCE: 1%  POWER: .25W  [PMG_RES_0805]  (hidden comment: RK73H2ATTD1003F)
R41  value 100K  TOLERANCE: 1%  POWER: .25W  [PMG_RES_0805]  (hidden comment: RK73H2ATTD1003F)
R42  value 100K  TOLERANCE: 1%  POWER: .25W  [PMG_RES_0805]  (hidden comment: RK73H2ATTD1003F)
R43  value 100K  TOLERANCE: 1%  POWER: .25W  [PMG_RES_0805]  (hidden comment: RK73H2ATTD1003F)
R44  value 10K  POWER: .5W  [BOURNS_3386F]  (hidden comment: 3386F-1-103TLF)
R45  value 10K  TOLERANCE: 1%  POWER: .25W  [RES_0805]  (hidden comment: SG73S2ATTD1002F)
R74  value 100K  TOLERANCE: 1%  POWER: .25W  [PMG_RES_0805]  (hidden comment: RK73H2ATTD1003F)
R75  value 100K  TOLERANCE: 1%  POWER: .25W  [PMG_RES_0805]  (hidden comment: RK73H2ATTD1003F)
SW1  220ADC16  [CTS_220ADC16]
TP8  TP_0635MM_HOLE  [TP_0635MM_HOLE]  (value not drawn)  (no BOM)
TP9  TP_0635MM_HOLE  [TP_0635MM_HOLE]  (value not drawn)  (no BOM)
TP10  TP_0635MM_HOLE  [TP_0635MM_HOLE]  (value not drawn)  (no BOM)
U7  value X Y Z 16g  [XDCR_LIS3DHTR]  (hidden comment: LIS3DHTR)
U8  value 3V  [4007]  (hidden comment: 4007)

### Nets
3V3: C51.1 C53.1 FB4.2 J8.12 J8.20 R38.2 R39.2 R40.2 R41.2 R42.2 R43.2 R45.2 U7.1(VIO) U7.14(VDD) U8.1(VDD)
5V: J8.18
GND: C51.2 C52.2 C53.2 J8.3 J8.8 J8.13 J8.19 Q3.2(E) Q4.2(E) R44.1 R74.2 R75.2 SW1.C1(COM) SW1.C2(COM) U7.5(GND) U7.10(RES) U7.12(GND) U8.4(GND)
VB1: J8.10 J8.11
ACEL_NEN: R45.1 U7.8(~{CS})
ADC1_IN5: C52.1 R44.2
HEX_1: R43.1 SW1.1(X1)
HEX_2: R42.1 SW1.2(X2)
HEX_4: R41.1 SW1.4(X4)
HEX_8: R40.1 SW1.8(X8)
I2C2_SCL: J8.4
I2C2_SDA: J8.5
MOD_IO0: J8.17
MOD_IO1: J8.16
PWM_GLED: Q4.1(B)
PWM_RLED: Q3.1(B)
SPI1_MISO: TP10.1 U7.7(SDO/SA0)
SPI1_MOSI: TP9.1 U7.6(SDA/SDI/SDO)
SPI1_SCK: TP8.1 U7.4(SCL/SPC)
SPI2_MISO: J8.7
SPI2_MOSI: J8.6
SPI2_SCK: J8.9
TYPE_ID0: J8.15 R75.1
TYPE_ID1: J8.14 R74.1
US_ECHO: U8.3(ECHO_TX)
US_TRIG: U8.2(TRIG_RX)
USART3_RX: J8.2
USART3_TX: J8.1
NetFB4_1: FB4.1 R44.3
NetLED2_1: LED2.1(K) Q3.3(C)
NetLED2_2: LED2.2(A) R38.1
NetLED2_3: LED2.3(K) Q4.3(C)
NetLED2_4: LED2.4(A) R39.1

Not connected (* = marked no-connect by the designer): U7 2(NC) 3(NC) 9(IRQ2) 11(IRQ1) 13(ADC3) 15(ADC2) 16(ADC1)

### Notes on the sheet
- UI ADC
- UI LED
- UI SWITCH
- HEXIDECIMAL
- UI ACCELEROMETER
- UI EXPANSION MODULE
- EXPANSION MODULE MUST PULL UP I2C OR ENABLE PULL-UP
- UI NOTES:
- EXPANSION MODULE USE TYPE_ID0 AND TYPE_ID1 TO SET MODULE TYPE
- SOFTWARE TO READ TYPE ID ON POR AND CONFIGURE ACCORDINGLY
- TYPE ID 00 = NO MODULE
- UI ULTRASONIC
- Title
- Size:
- Date:
- B
- Number:
- Engr:
- Revision:
- Sheet
- of
- File:

### Library data of the parts
C51-C53 = CAP_0.1UF_50V_0805: as C81 on sheet MainControllerPower; MFG_PN: 08055C104KAT2A; Supplier 1: Digi-Key; Supplier Part Number 1: 478-1395-1-ND; Case/Package: 0805
  C51: ClassName: UI_Accelerometer
  C52: ClassName: UI_ADC
  C53: ClassName: UI_UltraSonic
FB4 = FERRITE_BLM21AG102SN1D: as FB1 on sheet MainControllerPower; Supplier 1: Digi-Key; Supplier Part Number 1: 490-1041-1-ND; MFG_PN: BLM21AG102SN1D; ClassName: UI_ADC
J8 = CONN_TD_EXPANSION_MODULE: CONN HEADER VERT 5POS 2.54MM (NOTE: QTY x4); MFG: Sullins Connector Solutions; Case/Package: EXP_SLOT; MFG_PN: PPTC051LFBN-RC; Supplier 1: Digi-Key; Supplier Part Number 1: S6103-ND; Value: x4; ClassName: UI_Module
LED2 = LED_RED_GREEN_HSMF-A201-A00J1: LED GREEN/RED CLEAR 4PLCC SMD; MFG: Broadcom Limited; Case/Package: 4PLCC; Supplier 1: Digi-Key; Supplier Part Number 1: 516-2491-1-ND; MFG_PN: HSMF-A201-A00J1; ClassName: UI_LED
Q3 Q4 = MOSFET_NCH_2N7002-7-F: as Q2 on sheet SerialInterface; Case/Package: SOT-23; Supplier 1: Digi-Key; Supplier Part Number 1: 2N7002-FDICT-ND; MFG_PN: 2N7002-7-F; ClassName: UI_LED
R38 R39 = RES_120_0805_1/4W_1%: RES 120 OHM 1% 1/4W 0805; MFG: KOA Speer Electronics, Inc.; Case/Package: 0805; MFG_PN: RK73H2ATTD1200F; Supplier 1: Digi-Key; Supplier Part Number 1: 2019-RK73H2ATTD1200FCT-ND; ClassName: UI_LED
R40-R43 R74 R75 = RES_100K_0805_1/4W_1%: as R27 on sheet SystemMemory; Case/Package: 0805; MFG_PN: RK73H2ATTD1003F; Supplier 1: Digi-Key; Supplier Part Number 1: 2019-RK73H2ATTD1003FCT-ND
  R40-R43: ClassName: UI_HexSwitch
  R74 R75: ClassName: UI_Module
R44 = RES_POT_10K_500mW: TRIMMER 10K OHM 0.5W PC PIN TOP; MFG: Bourns Inc.; Case/Package: PIN TOP; MFG_PN: 3386F-1-103TLF; Supplier 1: Digi-Key; Supplier Part Number 1: 3386F-103TLF-ND; ClassName: UI_ADC
R45 = RES_10K_0805_1/4W_1%: as R9 on sheet MainControllerPower; Case/Package: 0805; MFG_PN: SG73S2ATTD1002F; Supplier 1: Digi-Key; Supplier Part Number 1: 2019-SG73S2ATTD1002FCT-ND; ClassName: UI_Accelerometer
SW1 = SW_DIP_220ADC16: SWITCH ROTARY DIP HEX 100MA 50V; MFG: CTS Electrocomponents; MFG_PN: 220ADC16; Supplier 1: DigiKey; Supplier Part Number 1: CT3070-ND; Value: HEX; Case/Package: 220ADC16; ClassName: UI_HexSwitch
TP8-TP10 = TP_0635MM_HOLE: 3MM IN D. MT HOLE
U7 = IC_LIS3DHTR: ACCEL 2-16G I2C/SPI 16LGA; MFG: STMicroelectronics; MFG_PN: LIS3DHTR; Supplier 1: Digi-Key; Supplier Part Number 1: 497-10613-1-ND; ClassName: UI_Accelerometer
U8 = MODULE_RCWL-1601: MODULE ULTRASONIC SENSOR 3V; MFG: Adafruit Industries LLC; Case/Package: 4007; Supplier 1: Digi-Key; Supplier Part Number 1: 1528-2832-ND; MFG_PN: 4007; ClassName: UI_UltraSonic

## Sheet AudioAmp.SchDoc: =ProjectTitle
size B; Date: 10/29/2020; Engineer: H. Collector; Organization: IMR Engineering; Address1: 3621 Gin Way; Address2: Snellville, GA 30039; Address3: USA; DocumentNumber: IMR_002; Revision: 1; SheetNumber: 8; SheetTotal: 10
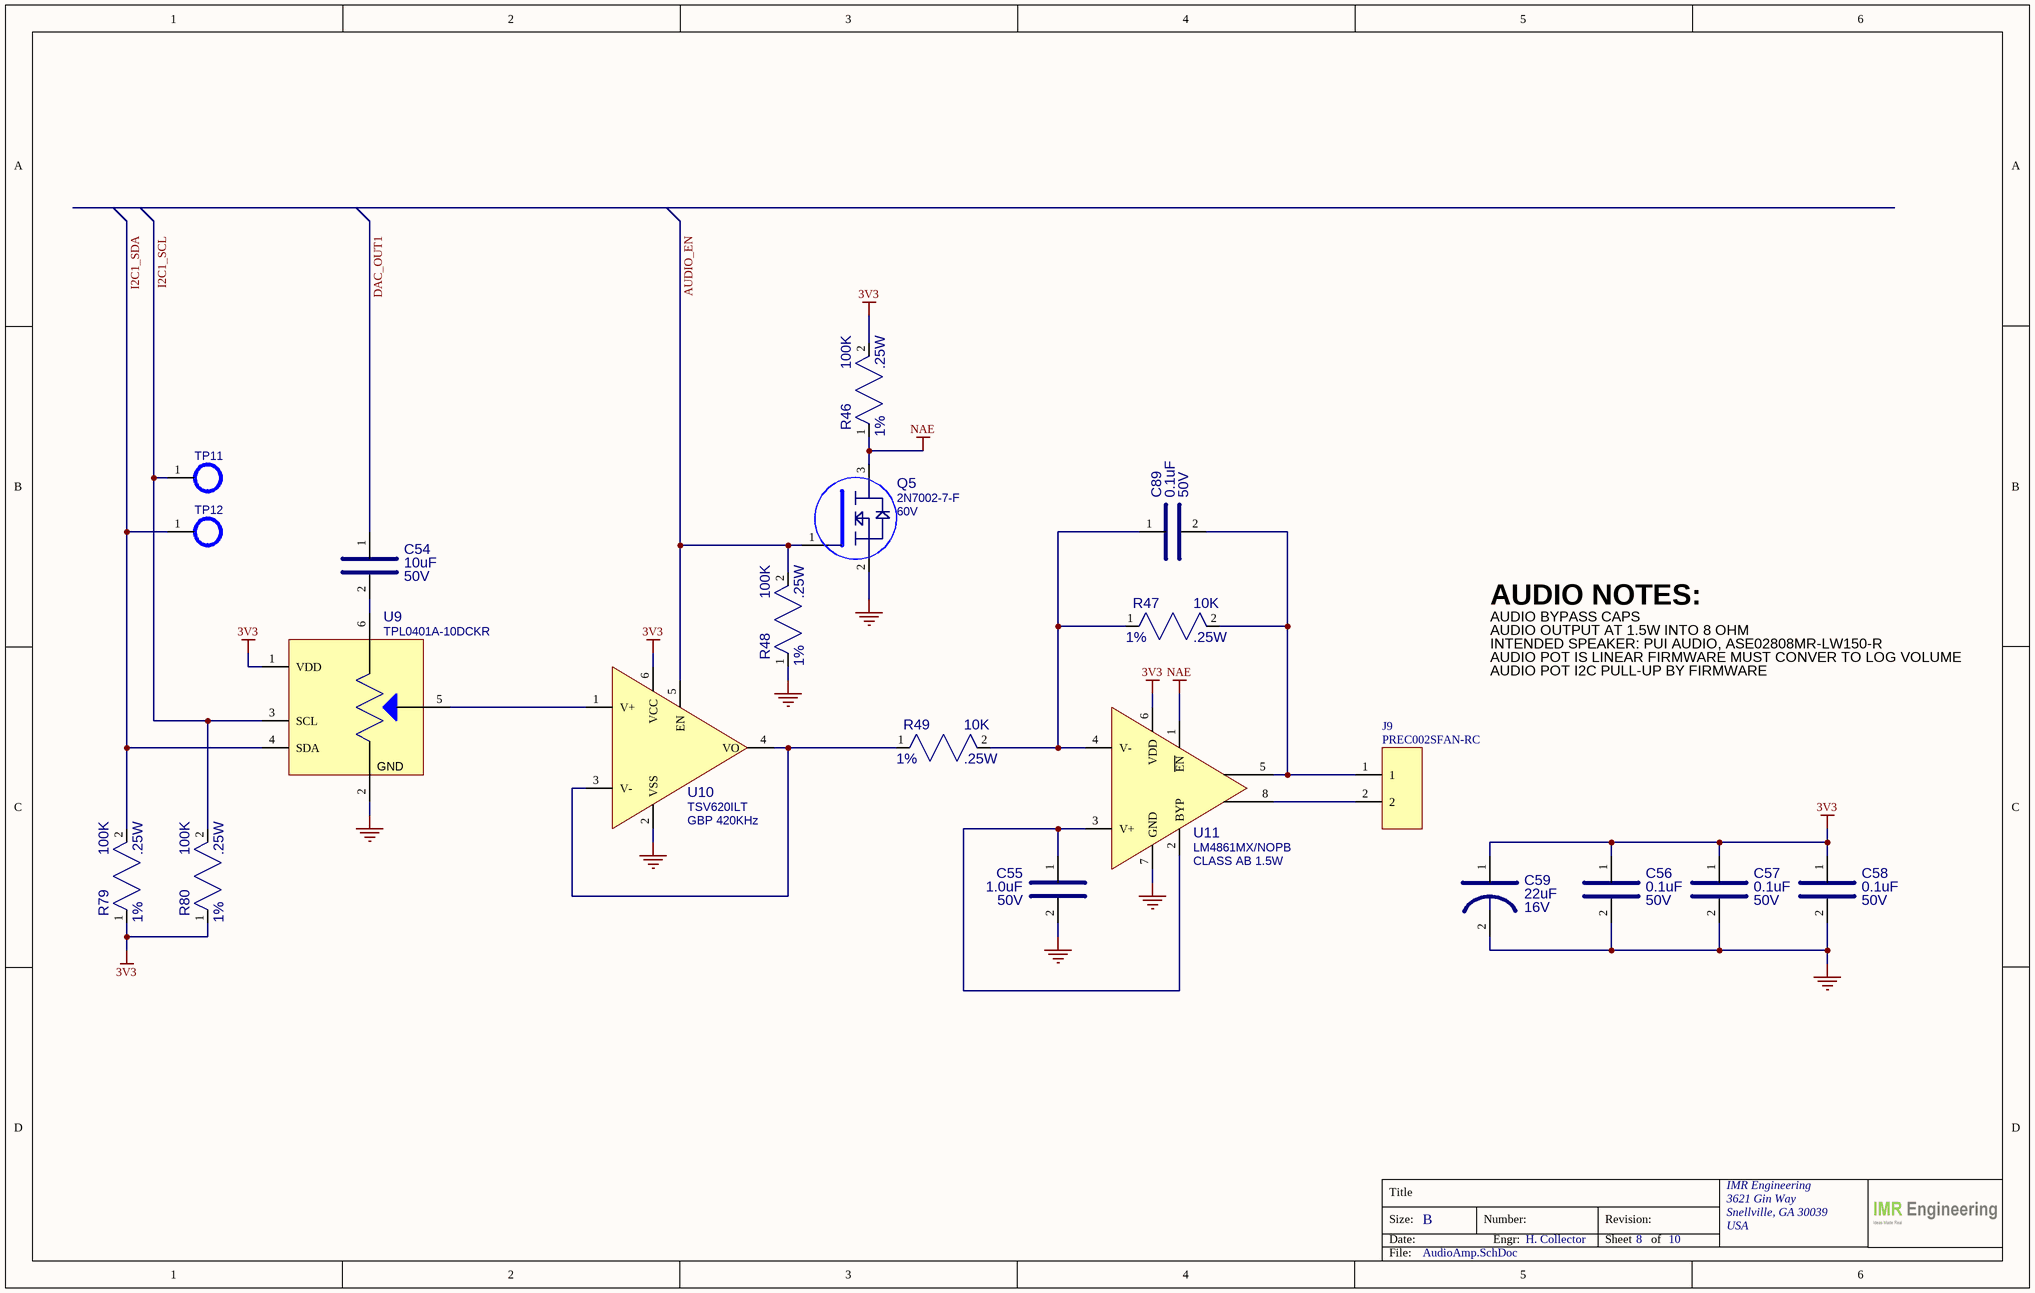
[diagram p7: AudioAmp.SchDoc]

### Parts
C54  value 10uF  VOLTAGE: 50V  [CAP_1206]  (hidden comment: CL31A106KBHNNNE)
C55  value 1.0uF  VOLTAGE: 50V  [CAP_0805]  (hidden comment: UMK212B7105MGHT)
C56  value 0.1uF  VOLTAGE: 50V  [CAP_0805]  (hidden comment: 08055C104KAT2A)
C57  value 0.1uF  VOLTAGE: 50V  [CAP_0805]  (hidden comment: 08055C104KAT2A)
C58  value 0.1uF  VOLTAGE: 50V  [CAP_0805]  (hidden comment: 08055C104KAT2A)
C59  value 22uF  VOLTAGE: 16V  [CAP_2312]  (hidden comment: TRJC226K016RRJ)
C89  value 0.1uF  VOLTAGE: 50V  [CAP_0805]  (hidden comment: 08055C104KAT2A)
J9  PREC002SFAN-RC  [HDR_1X2_100MILL]
Q5  value 60V  [SOT-23]  (hidden comment: 2N7002-7-F)
R46  value 100K  TOLERANCE: 1%  POWER: .25W  [PMG_RES_0805]  (hidden comment: RK73H2ATTD1003F)
R47  value 10K  TOLERANCE: 1%  POWER: .25W  [RES_0805]  (hidden comment: SG73S2ATTD1002F)
R48  value 100K  TOLERANCE: 1%  POWER: .25W  [PMG_RES_0805]  (hidden comment: RK73H2ATTD1003F)
R49  value 10K  TOLERANCE: 1%  POWER: .25W  [RES_0805]  (hidden comment: SG73S2ATTD1002F)
R79  value 100K  TOLERANCE: 1%  POWER: .25W  [PMG_RES_0805]  (hidden comment: RK73H2ATTD1003F)
R80  value 100K  TOLERANCE: 1%  POWER: .25W  [PMG_RES_0805]  (hidden comment: RK73H2ATTD1003F)
TP11  TP_0635MM_HOLE  [TP_0635MM_HOLE]  (value not drawn)  (no BOM)
TP12  TP_0635MM_HOLE  [TP_0635MM_HOLE]  (value not drawn)  (no BOM)
U9  value 10K  TOLERANCE: 20%  POWER: 5.5V  [SOT-363_6-TSSOP_SC-88]  (hidden comment: TPL0401A-10DCKR)
U10  value GBP 420KHz  [SOT23-6]  (hidden comment: TSV620ILT)
U11  value CLASS AB 1.5W  [SO-8]  (hidden comment: LM4861MX/NOPB)

### Nets
3V3: C56.1 C57.1 C58.1 C59.1 R46.2 R79.1 R80.1 U9.1(VDD) U10.6(VCC) U11.6(VDD)
GND: C55.2 C56.2 C57.2 C58.2 C59.2 Q5.2(E) R48.1 U9.2(GND) U10.2(VSS) U11.7(GND)
NAE: Q5.3(C) R46.1 U11.1(~{EN})
AUDIO_EN: Q5.1(B) R48.2 U10.5(EN)
DAC_OUT1: C54.1
I2C1_SCL: R80.2 TP11.1 U9.3(SCL)
I2C1_SDA: R79.2 TP12.1 U9.4(SDA)
NetC54_2: C54.2 U9.6(H)
NetC55_1: C55.1 U11.2(BYP) U11.3(V+)
NetC89_1: C89.1 R47.1 R49.2 U11.4(V-)
NetC89_2: C89.2 J9.1 R47.2 U11.5(VO1)
NetJ9_2: J9.2 U11.8(VO2)
NetR49_1: R49.1 U10.3(V-) U10.4(VO)
NetU9_5: U9.5(W) U10.1(V+)

### Notes on the sheet
- AUDIO NOTES:
- AUDIO BYPASS CAPS
- AUDIO OUTPUT AT 1.5W INTO 8 OHM
- INTENDED SPEAKER: PUI AUDIO, ASE02808MR-LW150-R
- AUDIO POT IS LINEAR FIRMWARE MUST CONVER TO LOG VOLUME
- AUDIO POT I2C PULL-UP BY FIRMWARE
- Title
- Size:
- Date:
- B
- Number:
- Engr:
- Revision:
- Sheet
- of
- File:

### Library data of the parts
C54 = CAP_10UF_50V_1206: as C84 on sheet LCD_TouchBackLight; MFG_PN: CL31A106KBHNNNE; Supplier 1: Digi-Key; Supplier Part Number 1: 1276-2876-1-ND; Case/Package: 0805
C55 = CAP_1.0UF_50V_0805: CAP CER 1UF 50V X7R 0805; MFG: Taiyo Yuden; TOLERANCE: 20%; MFG_PN: UMK212B7105MGHT; Supplier 1: Digi-Key; Supplier Part Number 1: 587-6375-1-ND; Case/Package: 0805
C56-C58 C89 = CAP_0.1UF_50V_0805: as C81 on sheet MainControllerPower; MFG_PN: 08055C104KAT2A; Supplier 1: Digi-Key; Supplier Part Number 1: 478-1395-1-ND; Case/Package: 0805
C59 = CAP_22UF_16V_TANT: CAP TANT 22UF 20% 16V 2312; MFG: AVX Corporation; TOLERANCE: 10%; MFG_PN: TRJC226K016RRJ; Supplier 1: Digi-Key; Supplier Part Number 1: 478-11127-1-ND
J9 = CONN_2P_SINGLE_ROW: CONN HEADER VERT 2POS 2.54MM; MFG: Sullins Connector Solutions; Case/Package: 2P_2.54MM; MFG_PN: PREC002SFAN-RC; Supplier 1: Digi-Key; Supplier Part Number 1: S1212EC-02-ND; Value: *
Q5 = MOSFET_NCH_2N7002-7-F: as Q2 on sheet SerialInterface; Case/Package: SOT-23; Supplier 1: Digi-Key; Supplier Part Number 1: 2N7002-FDICT-ND; MFG_PN: 2N7002-7-F
R46 R48 R79 R80 = RES_100K_0805_1/4W_1%: as R27 on sheet SystemMemory; Case/Package: 0805; MFG_PN: RK73H2ATTD1003F; Supplier 1: Digi-Key; Supplier Part Number 1: 2019-RK73H2ATTD1003FCT-ND
  R79 R80: ClassName: UI_Module
R47 R49 = RES_10K_0805_1/4W_1%: as R9 on sheet MainControllerPower; Case/Package: 0805; MFG_PN: SG73S2ATTD1002F; Supplier 1: Digi-Key; Supplier Part Number 1: 2019-SG73S2ATTD1002FCT-ND
TP11 TP12 = TP_0635MM_HOLE: 3MM IN D. MT HOLE
U9 = IC_TPL0401A-10DCKR: IC DGTL POT 10KOHM 128TAP SC70-6; MFG: Texas Instruments; Case/Package: SC70-6; MFG_PN: TPL0401A-10DCKR; Supplier 1: Digi-Key; Supplier Part Number 1: 296-29676-1-ND
U10 = IC_OPAMP_TSV620ILT: IC OPAMP GP 1 CIRCUIT SOT23-6; MFG: STMicroelectronics; Supplier 1: Digi-Key; Supplier Part Number 1: 497-10160-1-ND; Case/Package: SOT23-6; MFG_PN: TSV620ILT
U11 = IC_OPAMP_LM4861: IC AMP CLASS AB MONO 1.5W 8SOIC; MFG: Texas Instruments; Supplier 1: Digi-Key; Supplier Part Number 1: 296-38566-1-ND; Case/Package: 8SOIC; MFG_PN: LM4861MX/NOPB